# Altium project COB with RK3399.PrjPcb (part 3 of 5)

## Sheet WIFI Module Page.SchDoc: RK3399 COB Design V1.0
size A3; Author: AVIRAL MISHRA; DocumentNumber: 14; SheetNumber: 14; SheetTotal: 27; PROJECT CODE: A_V1.0
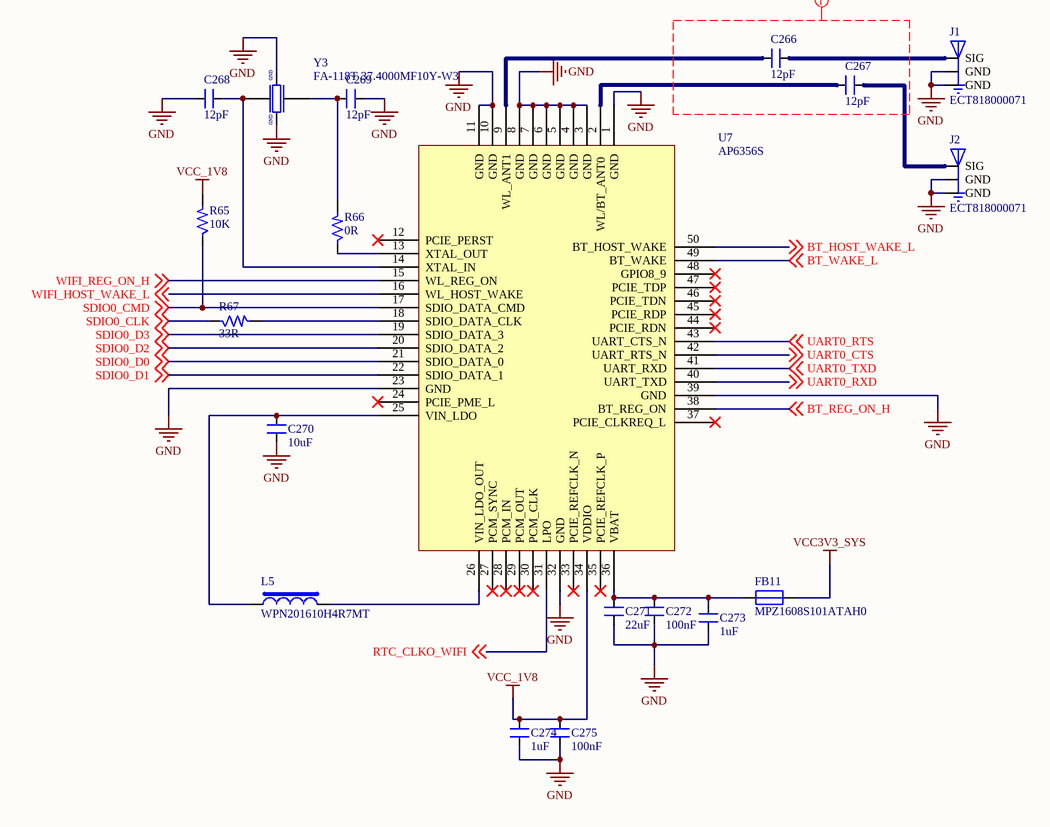
[diagram p13: WIFI Module Page.SchDoc]

### Parts
C266  12pF  [CAP_0603]
C267  12pF  [CAP_0603]
C268  12pF  [CAP_0603]
C269  12pF  [CAP_0603]
C270  10uF  [CAP_0603]
C271  22uF  [CAP_0603]
C272  100nF  [CAP_0805]
C273  1uF  [CAP_0603]
C274  1uF  [CAP_0603]
C275  100nF  [CAP_0805]
FB11  MPZ1608S101ATAH0  [RES_0603]
J1  ECT818000071  [CON3_UFL_116_SMD_ST]
J2  ECT818000071  [CON3_UFL_116_SMD_ST]
L5  WPN201610H4R7MT  [IND_62.9_110X86.6_SMD]
R65  10K  [RES_0603]
R66  0R  [RES_0603]
R67  33R  [RES_0402]
U7  AP6356S  [QFN127P600-8N]
Y3  FA-118T 37.4000MF10Y-W3  [XTAL_FA-118T 37.4000MF10Y-W3]

### Nets
GND: C268.1 C269.2 C270.1 C271.1 C272.1 C273.1 C274.1 C275.1 J1.1(GND) J1.3(GND) J2.1(GND) J2.3(GND) U7.1(GND) U7.3(GND) U7.4(GND) U7.5(GND) U7.6(GND) U7.7(GND) U7.8(GND) U7.10(GND) U7.11(GND) U7.23(GND) U7.32(GND) U7.39(GND) Y3.2 Y3.4
VCC3V3_SYS: FB11.2
VCC_1V8: C274.2 C275.2 R65.2 U7.34(VDDIO)
BT_HOST_WAKE_L: U7.50(BT_HOST_WAKE) ; off-sheet BT_HOST_WAKE_L
BT_REG_ON_H: U7.38(BT_REG_ON) ; off-sheet BT_REG_ON_H
BT_WAKE_L: U7.49(BT_WAKE) ; off-sheet BT_WAKE_L
RTC_CLKO_WIFI: U7.31(LPO) ; off-sheet RTC_CLKO_WIFI
SDIO0_CLK: R67.1 ; off-sheet SDIO0_CLK
SDIO0_CMD: R65.1 U7.17(SDIO_DATA_CMD) ; off-sheet SDIO0_CMD
SDIO0_D0: U7.21(SDIO_DATA_0) ; off-sheet SDIO0_D0
SDIO0_D1: U7.22(SDIO_DATA_1) ; off-sheet SDIO0_D1
SDIO0_D2: U7.20(SDIO_DATA_2) ; off-sheet SDIO0_D2
SDIO0_D3: U7.19(SDIO_DATA_3) ; off-sheet SDIO0_D3
UART0_CTS: U7.42(UART_RTS_N) ; off-sheet UART0_CTS
UART0_RTS: U7.43(UART_CTS_N) ; off-sheet UART0_RTS
UART0_RXD: U7.40(UART_TXD) ; off-sheet UART0_RXD
UART0_TXD: U7.41(UART_RXD) ; off-sheet UART0_TXD
WIFI_HOST_WAKE_L: U7.16(WL_HOST_WAKE) ; off-sheet WIFI_HOST_WAKE_L
WIFI_REG_ON_H: U7.15(WL_REG_ON) ; off-sheet WIFI_REG_ON_H
NetC266_1: C266.1 U7.9(WL_ANT1)
NetC266_2: C266.2 J1.2(SIG)
NetC267_1: C267.1 U7.2(WL/BT_ANT0)
NetC267_2: C267.2 J2.2(SIG)
NetC268_2: C268.2 U7.14(XTAL_IN) Y3.1
NetC269_1: C269.1 R66.2 Y3.3
NetC270_2: C270.2 L5.1 U7.25(VIN_LDO)
NetC271_2: C271.2 C272.2 C273.2 FB11.1 U7.36(VBAT)
NetL5_2: L5.2 U7.26(VIN_LDO_OUT)
NetR66_1: R66.1 U7.13(XTAL_OUT)
NetR67_2: R67.2 U7.18(SDIO_DATA_CLK)

Not connected (* = marked no-connect by the designer): U7 12(PCIE_PERST)* 24(PCIE_PME_L)* 27(PCM_SYNC)* 28(PCM_IN)* 29(PCM_OUT)* 30(PCM_CLK)* 33(PCIE_REFCLK_N)* 35(PCIE_REFCLK_P)* 37(PCIE_CLKREQ_L)* 44(PCIE_RDN)* 45(PCIE_RDP)* 46(PCIE_TDN)* 47(PCIE_TDP)* 48(GPIO8_9)*

### Layout directives
net class 50OHM_ANT: (no net found under the mark)

### Notes on the sheet
- TITLE:
- DOCUMENT NAME:
- SCALE 1:1
- This document is copyright of EsteemPCB and shall not be revealed, produced, copied, in whole or in part, nor
- PROJECT CODE:
- TEMPLATE:
- A4
- AUTHOR:
- Sheet
- of
- used for any purpose other than submitted.
- (in symbol XTAL_37.4 MHz-12pF-SMD) GND

### Library data of the parts
C266-C269 = CAP_12pF-10V-10%-0603: 12pF ±10% 10V Ceramic Capacitor X8R 0603 (1608 Metric) /; Manufacturer: KEMET; Manufacturer Part Number: C0603X120K8HAC7867; Case/Package: 0603; Supplier-1: Digikey
C270 = CAP_10uF-10V-10%-0603: 10µF ±10% 10V Ceramic Capacitor X5R 0603 (1608 Metric) /; Manufacturer Part Number: GRM188R61A106KE69J; Manufacturer: Murata Electronics; Case/Package: 0603; Supplier-1: Digikey
C271 = CAP_22uF-10V-20%-0603: as C218 on sheet PMIC_Block; Case/Package: 0603; Supplier-1: Digikey
C272 C275 = CAP_100nF-25V-10%-0805: 0.1µF ±10% 25V Ceramic Capacitor X7R 0805 (2012 Metric) /; Manufacturer: Yageo; Manufacturer Part Number: CC0805KRX7R8BB104; Case/Package: 0805; Supplier-1: Digikey
C273 C274 = CAP_1uF-16V-10%-0603: 1µF ±10% 16V Ceramic Capacitor X7R 0603 (1608 Metric) /; Manufacturer: Yageo; Manufacturer Part Number: CC0603KRX7R7BB105; Case/Package: 0603; Supplier-1: Digikey
FB11 = FB_100R-3A-100Mhz-0603: Ferrite Beads 100ohms 3A 30mOhms 0603 Ferrite Chip; Manufacturer: TDK; Mnaufacturer Part Number: MPZ1608S101ATAH0; Case/Package: 0603; Supplier-1: Digikey
J1 J2 = CON-PLG_3X1-ECT818000071-ST-SMD: SMD RF Connectors/Coaxial Connectors RoHS; Manufacturer: ECT; Manufacturer Part Number: ECT818000071; Case/Package: SMD; Supplier-1: LCSC
L5 = IND_4.7uH-0.9A-20%-SMD: 4.7uH ±20% 900mA 425mΩ SMD,2.0x1.6x1.0mm Power Inductors RoHS /; Manufacturer: Sunlord; Manufacturer Part Number: WPN201610H4R7MT; Case/Package: SMD; Supplier-1: LCSC
R65 = RES_10K-0.1W-1%-0603: 10 kOhms ±1% 0.1W, 1/10W Chip Resistor 0603 (1608 Metric) Thick Film /; Manufacturer: Yageo; Manufacturer Part Number: RC0603FR-0710KL; Case/Package: 0603; Supplier-1: Digikey
R66 = RES_0R-0.1W-1%-0603: 0 Ohms Jumper 0.1W, 1/10W Chip Resistor 0603 (1608 Metric) Thick Film; Manufacturer: Yageo; Manufacturer Part Number: RC0603JR-070RL; Case/Package: 0603; Supplier-1: Digikey
R67 = RES_33R-0.1W-1%-0402: 33 Ohms ±1% 0.1W, 1/10W Chip Resistor 0402 (1005 Metric) Automotive AEC-Q200 Thick Film /; Manufacturer: Panasonic Electronic Components; Manufacturer Part Number: ERJ-2RKF33R0X; Case/Package: 0402; Supplier-1: Digikey
U7 = IC_AP6356S: AMPAK Technology would like to announce a low-cost and low-power consumption module / which has all of the WiFi and Bluetooth functionalities.; Manufacturer: Rockchip; Manufacturer Part Number: AP6356S; Case/Package: NA; Supplier-1: Rockchip
Y3 = XTAL_37.4 MHz-12pF-SMD: Crystals 37.4MHz 10ppm 12pF -30C +85C; Manufacturer: Epson Timing; Manufacturer Part Number: FA-118T 37.4000MF10Y-W3; Case/Package: SMD; Supplier-1: Mouser

## Sheet Regulators and Buck Converters.SchDoc: RK3399 COB Design V1.0
size A3; Author: ABC; Organization: Altium Limited; Address1: L3, 12a Rodborough Rd; Address2: Frenchs Forest; Address3: NSW; Address4: Australia 2086; DocumentNumber: 15; SheetNumber: 15; SheetTotal: 27; PROJECT CODE: A_V1.0
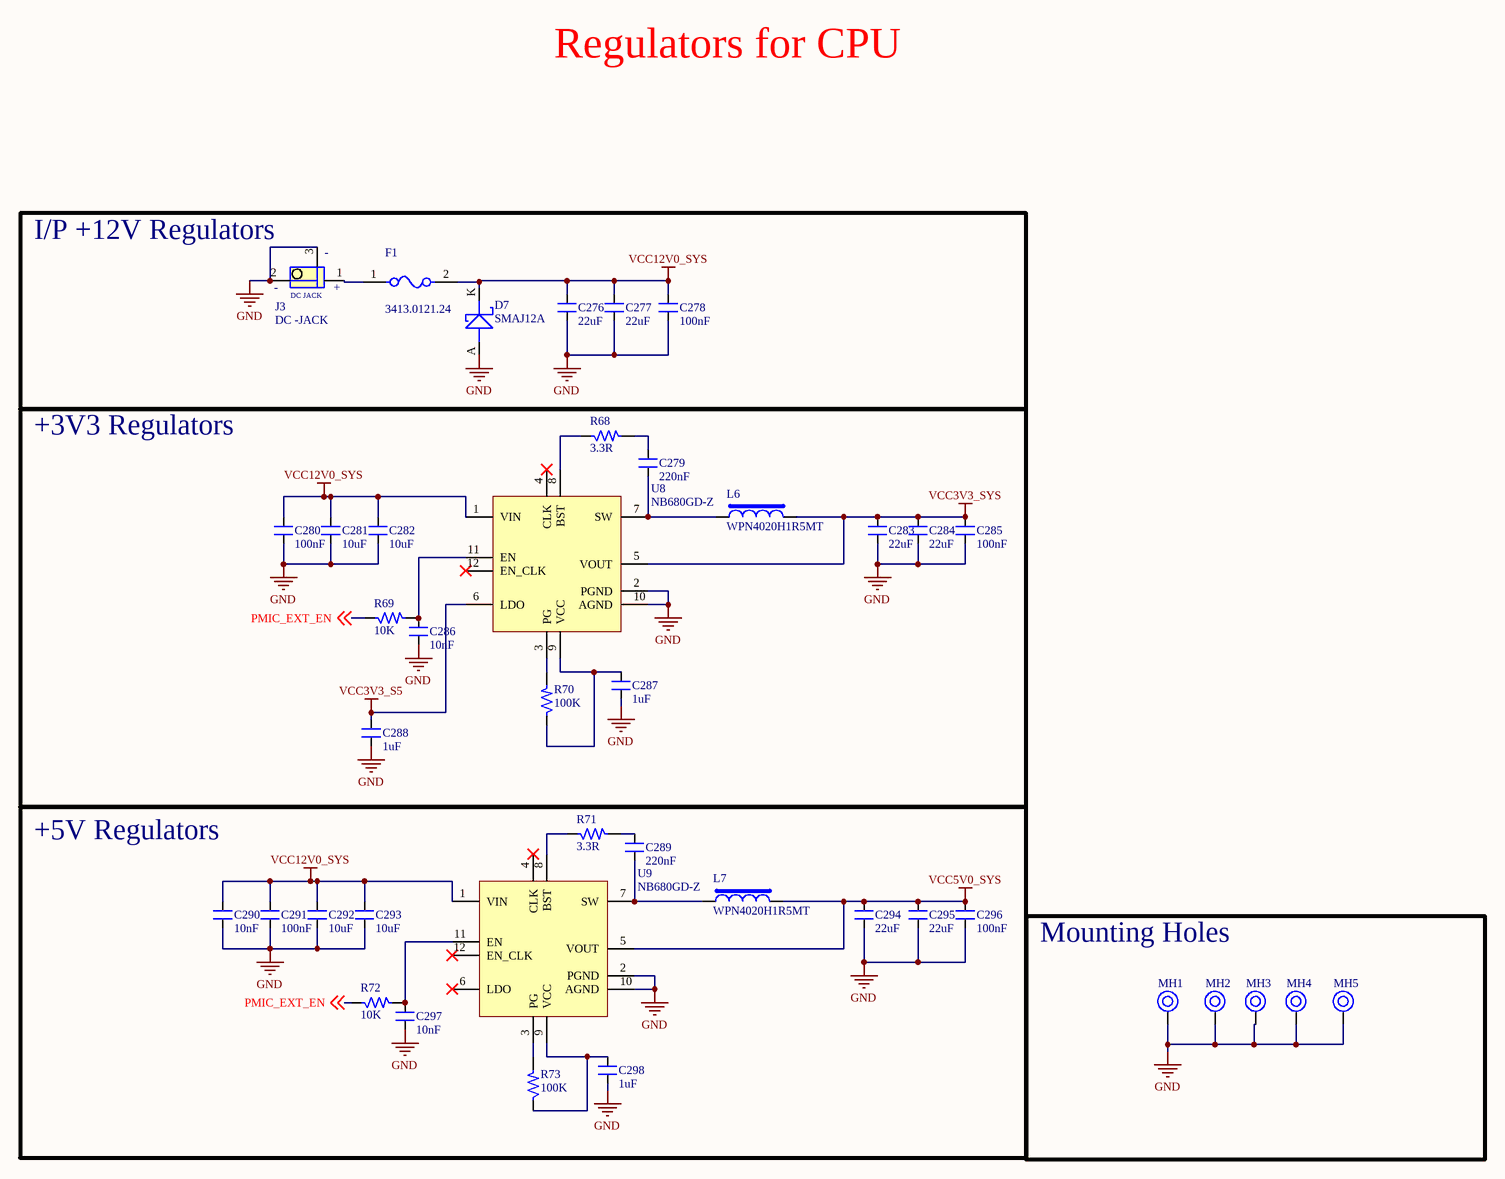
[diagram p14: Regulators and Buck Converters.SchDoc]

### Parts
C276  22uF  [CAP_0805]
C277  22uF  [CAP_0805]
C278  100nF  [CAP_0805]
C279  220nF  [CAP_0603]
C280  100nF  [CAP_0805]
C281  10uF  [CAP_0805]
C282  10uF  [CAP_0805]
C283  22uF  [CAP_0805]
C284  22uF  [CAP_0805]
C285  100nF  [CAP_0603]
C286  10nF  [CAP_0603]
C287  1uF  [CAP_0603]
C288  1uF  [CAP_0603]
C289  220nF  [CAP_0603]
C290  10nF  [CAP_0603]
C291  100nF  [CAP_0805]
C292  10uF  [CAP_0805]
C293  10uF  [CAP_0805]
C294  22uF  [CAP_0805]
C295  22uF  [CAP_0805]
C296  100nF  [CAP_0603]
C297  10nF  [CAP_0603]
C298  1uF  [CAP_0603]
D7  SMAJ12A  [DIO_SMA_DO-214AC]
F1  3413.0121.24  [RES_1206]
J3  DC -JACK  [CON3_129_PJ-002A_TH_RA]
L6  WPN4020H1R5MT  [IND_1616]
L7  WPN4020H1R5MT  [IND_1616]
MH1  Mounting Hole  [MOUNTING]  (value not drawn)  (no BOM)
MH2  Mounting Hole  [MOUNTING]  (value not drawn)  (no BOM)
MH3  Mounting Hole  [MOUNTING]  (value not drawn)  (no BOM)
MH4  Mounting Hole  [MOUNTING]  (value not drawn)  (no BOM)
MH5  Mounting Hole  [MOUNTING]  (value not drawn)  (no BOM)
R68  3.3R  [RES_0603]
R69  10K  [RES_0603]
R70  100K  [RES_0603]
R71  3.3R  [RES_0603]
R72  10K  [RES_0603]
R73  100K  [RES_0603]
U8  NB680GD-Z  [QFN-12_19_118X118_SMD]
U9  NB680GD-Z  [QFN-12_19_118X118_SMD]

### Blocks framed on the sheet
I/P +12V Regulators: C276-C278 D7 F1 J3
+3V3 Regulators: C279-C288 L6 R68-R70 U8
+5V Regulators: C289-C298 L7 R71-R73 U9
Mounting Holes: MH1-MH5

### Nets
GND: C276.1 C277.1 C278.1 C280.1 C281.1 C282.1 C283.1 C284.1 C285.1 C286.1 C287.1 C288.1 C290.1 C291.1 C292.1 C293.1 C294.1 C295.1 C296.1 C297.1 C298.1 D7.A J3.2 J3.3(-) MH1.1 MH2.1 MH3.1 MH4.1 MH5.1 U8.2(PGND) U8.10(AGND) U9.2(PGND) U9.10(AGND)
VCC3V3_S5: C288.2 U8.6(LDO)
VCC3V3_SYS: C283.2 C284.2 C285.2 L6.2 U8.5(VOUT)
VCC5V0_SYS: C294.2 C295.2 C296.2 L7.2 U9.5(VOUT)
VCC12V0_SYS: C276.2 C277.2 C278.2 C280.2 C281.2 C282.2 C290.2 C291.2 C292.2 C293.2 D7.K F1.2 U8.1(VIN) U9.1(VIN)
PMIC_EXT_EN: R69.1 R72.1 ; off-sheet PMIC_EXT_EN
NetC279_1: C279.1 L6.1 U8.7(SW)
NetC279_2: C279.2 R68.2
NetC286_2: C286.2 R69.2 U8.11(EN)
NetC287_2: C287.2 R70.1 U8.9(VCC)
NetC289_1: C289.1 L7.1 U9.7(SW)
NetC289_2: C289.2 R71.2
NetC297_2: C297.2 R72.2 U9.11(EN)
NetC298_2: C298.2 R73.1 U9.9(VCC)
NetF1_1: F1.1 J3.1
NetR68_1: R68.1 U8.8(BST)
NetR70_2: R70.2 U8.3(PG)
NetR71_1: R71.1 U9.8(BST)
NetR73_2: R73.2 U9.3(PG)

Not connected (* = marked no-connect by the designer): U8 4(CLK)* 12(EN_CLK)*; U9 4(CLK)* 6(LDO)* 12(EN_CLK)*

### Notes on the sheet
- Regulators for CPU
- TITLE:
- DOCUMENT NAME:
- SCALE 1:1
- This document is copyright of Esteempcb and shall not be revealed, produced, copied, in whole or in part, nor
- PROJECT CODE:
- TEMPLATE:
- A3
- AUTHOR:
- Sheet
- of
- used for any purpose other than submitted.
- (in symbol CON-PLG_3X1-228-DC_JACK) +; DC JACK

### Library data of the parts
C276 C277 C283 C284 C294 C295 = CAP_22uF-25V-20%-0805: 22µF ±20% 25V Ceramic Capacitor X5R 0805 (2012 Metric) /; Manufacturer: Murata Electronics; Manufacturer Part Number: GRM21BR61E226ME44K; Case/Package: 0805; Supplier-1: Digikey
C278 C280 C291 = CAP_100nF-25V-10%-0805: 0.1µF ±10% 25V Ceramic Capacitor X7R 0805 (2012 Metric) /; Manufacturer: Yageo; Manufacturer Part Number: CC0805KRX7R8BB104; Case/Package: 0805; Supplier-1: Digikey
C279 C289 = CAP_220nF-10V-10%-0603: 0.22µF ±10% 10V Ceramic Capacitor X7R 0603 (1608 Metric) /; Manufacturer: Yageo; Manufacturer Part Number: CC0603KRX7R6BB224; Case/Package: 0603; Supplier-1: Digikey
C281 C282 C292 C293 = CAP_10uF-25V-10%-0805: 10µF ±10% 25V Ceramic Capacitor X5R 0805 (2012 Metric) /; Manufacturer: Murata Electronics; Manufacturer Part Number: GRM21BR61E106KA73K; Case/Package: 0805; Supplier-1: Digikey
C285 C296 = CAP_100nF-10V-5%-0603: 0.1µF ±10% 10V Ceramic Capacitor X7R 0603 (1608 Metric) /; Manufacturer: Yageo; Manufacturer Part Number: CC0603KRX7R6BB104; Case/Package: 0603; Supplier-1: Digikey
C286 C290 C297 = CAP_10nF-10V-10%-0603: 10000pF ±10% 10V Ceramic Capacitor X7R 0603 (1608 Metric) /; Manufacturer: KEMET; Manufacturer Part Number: C0603C103K8RACTU; Case/Package: 0603; Supplier-1: Digikey
C287 C288 C298 = CAP_1uF-10V-5%-0603: 1µF ±10% 10V Ceramic Capacitor X5R 0603 (1608 Metric) /; Manufacturer: Samsung Electro-Mechanics; Manufacturer Part Number: CL10A105KP8NNNC; Case/Package: 0603; Supplier-1: Digikey
D7 = DIO-T_13.3V-19.9V-20.1A-DO-214AC: 19.9V Clamp 20.1A Ipp Tvs Diode Surface Mount DO-214AC (SMA); Manufacturer: Littelfuse Inc.; Manufacturer Part Number: SMAJ12A; Case/Package: DO-214AC; Supplier-1: Digikey
F1 = FUSE_3A-32V-1206: 3A 32V AC 63V DC Fuse Board Mount (Cartridge Style Excluded) Surface Mount 1206 (3216 Metric); Manufacturer: Schurter Inc.; Manufacturer Part Number: 3413.0121.24; Case/Package: 1206; Supplier-1: Digikey
J3 = CON-PLG_3X1-228-DC_JACK: 3 Pins, 1 Row 228mil Pitch, right angle Connector, male; Manufacturer: JST; Manufacturer Part Number: PJ-002A; Case/Package: TH-CON; Supplier-1: SP ROAD
L6 L7 = IND_1.5uH-6A-20%-SMD: Wire Wound SMD Power Inductors – WPN Series / Operating Temp. : -40℃~+125℃ (Including self-heating) /; Manufacturer: Sunlord; Mnaufcaturer Part Number: WPN4020H1R5MT; Case/Package: SMD; Supplier-1: NA
MH1-MH5 = MH_3.5H_6D: Manufacturer Part Number: NA; Case/Package: TH; Manufacturer: NA; Supplier-1: NA
R68 R71 = RES_3.3R-0.1W-1%-0603: 3.3 Ohms ±1% 0.1W, 1/10W Chip Resistor 0603 (1608 Metric) Automotive AEC-Q200, Current Sense Thick Film /; Manufacturer: Panasonic Electronic Components; Manufacturer Part Number: ERJ-3RQF3R3V; Case/Package: 0603; Supplier-1: Digikey
R69 R72 = RES_10K-0.1W-1%-0603: 10 kOhms ±1% 0.1W, 1/10W Chip Resistor 0603 (1608 Metric) Thick Film /; Manufacturer: Yageo; Manufacturer Part Number: RC0603FR-0710KL; Case/Package: 0603; Supplier-1: Digikey
R70 R73 = RES_100K-0.1W-1%-0603: 100 kOhms ±1% 0.1W, 1/10W Chip Resistor 0603 (1608 Metric) Automotive AEC-Q200 Thick Film /; Manufacturer: tackpole Electronics Inc; Manufacturer Part Number: RMCF0603FT100K; Case/Package: 0603; Supplier-1: Digikey
U8 U9 = REG_3.3V-26V-8A-QFN-12: Switching Voltage Regulators 26V Fixed 3.3 V-8A Sync Buck Converter; Manufacturer: Monolithic Power Systems (MPS); Manufacturer Part Number: NB680GD-Z; Case/Package: QFN-12; Supplier-1: Mouser

## Sheet Power Supply for CPU Blocks.SchDoc: RK3399 COB Design V1.0
size A3; Author: ABC; Organization: Altium Limited; Address1: L3, 12a Rodborough Rd; Address2: Frenchs Forest; Address3: NSW; Address4: Australia 2086; DocumentNumber: 16; SheetNumber: 16; SheetTotal: 27; PROJECT CODE: A_V1.0
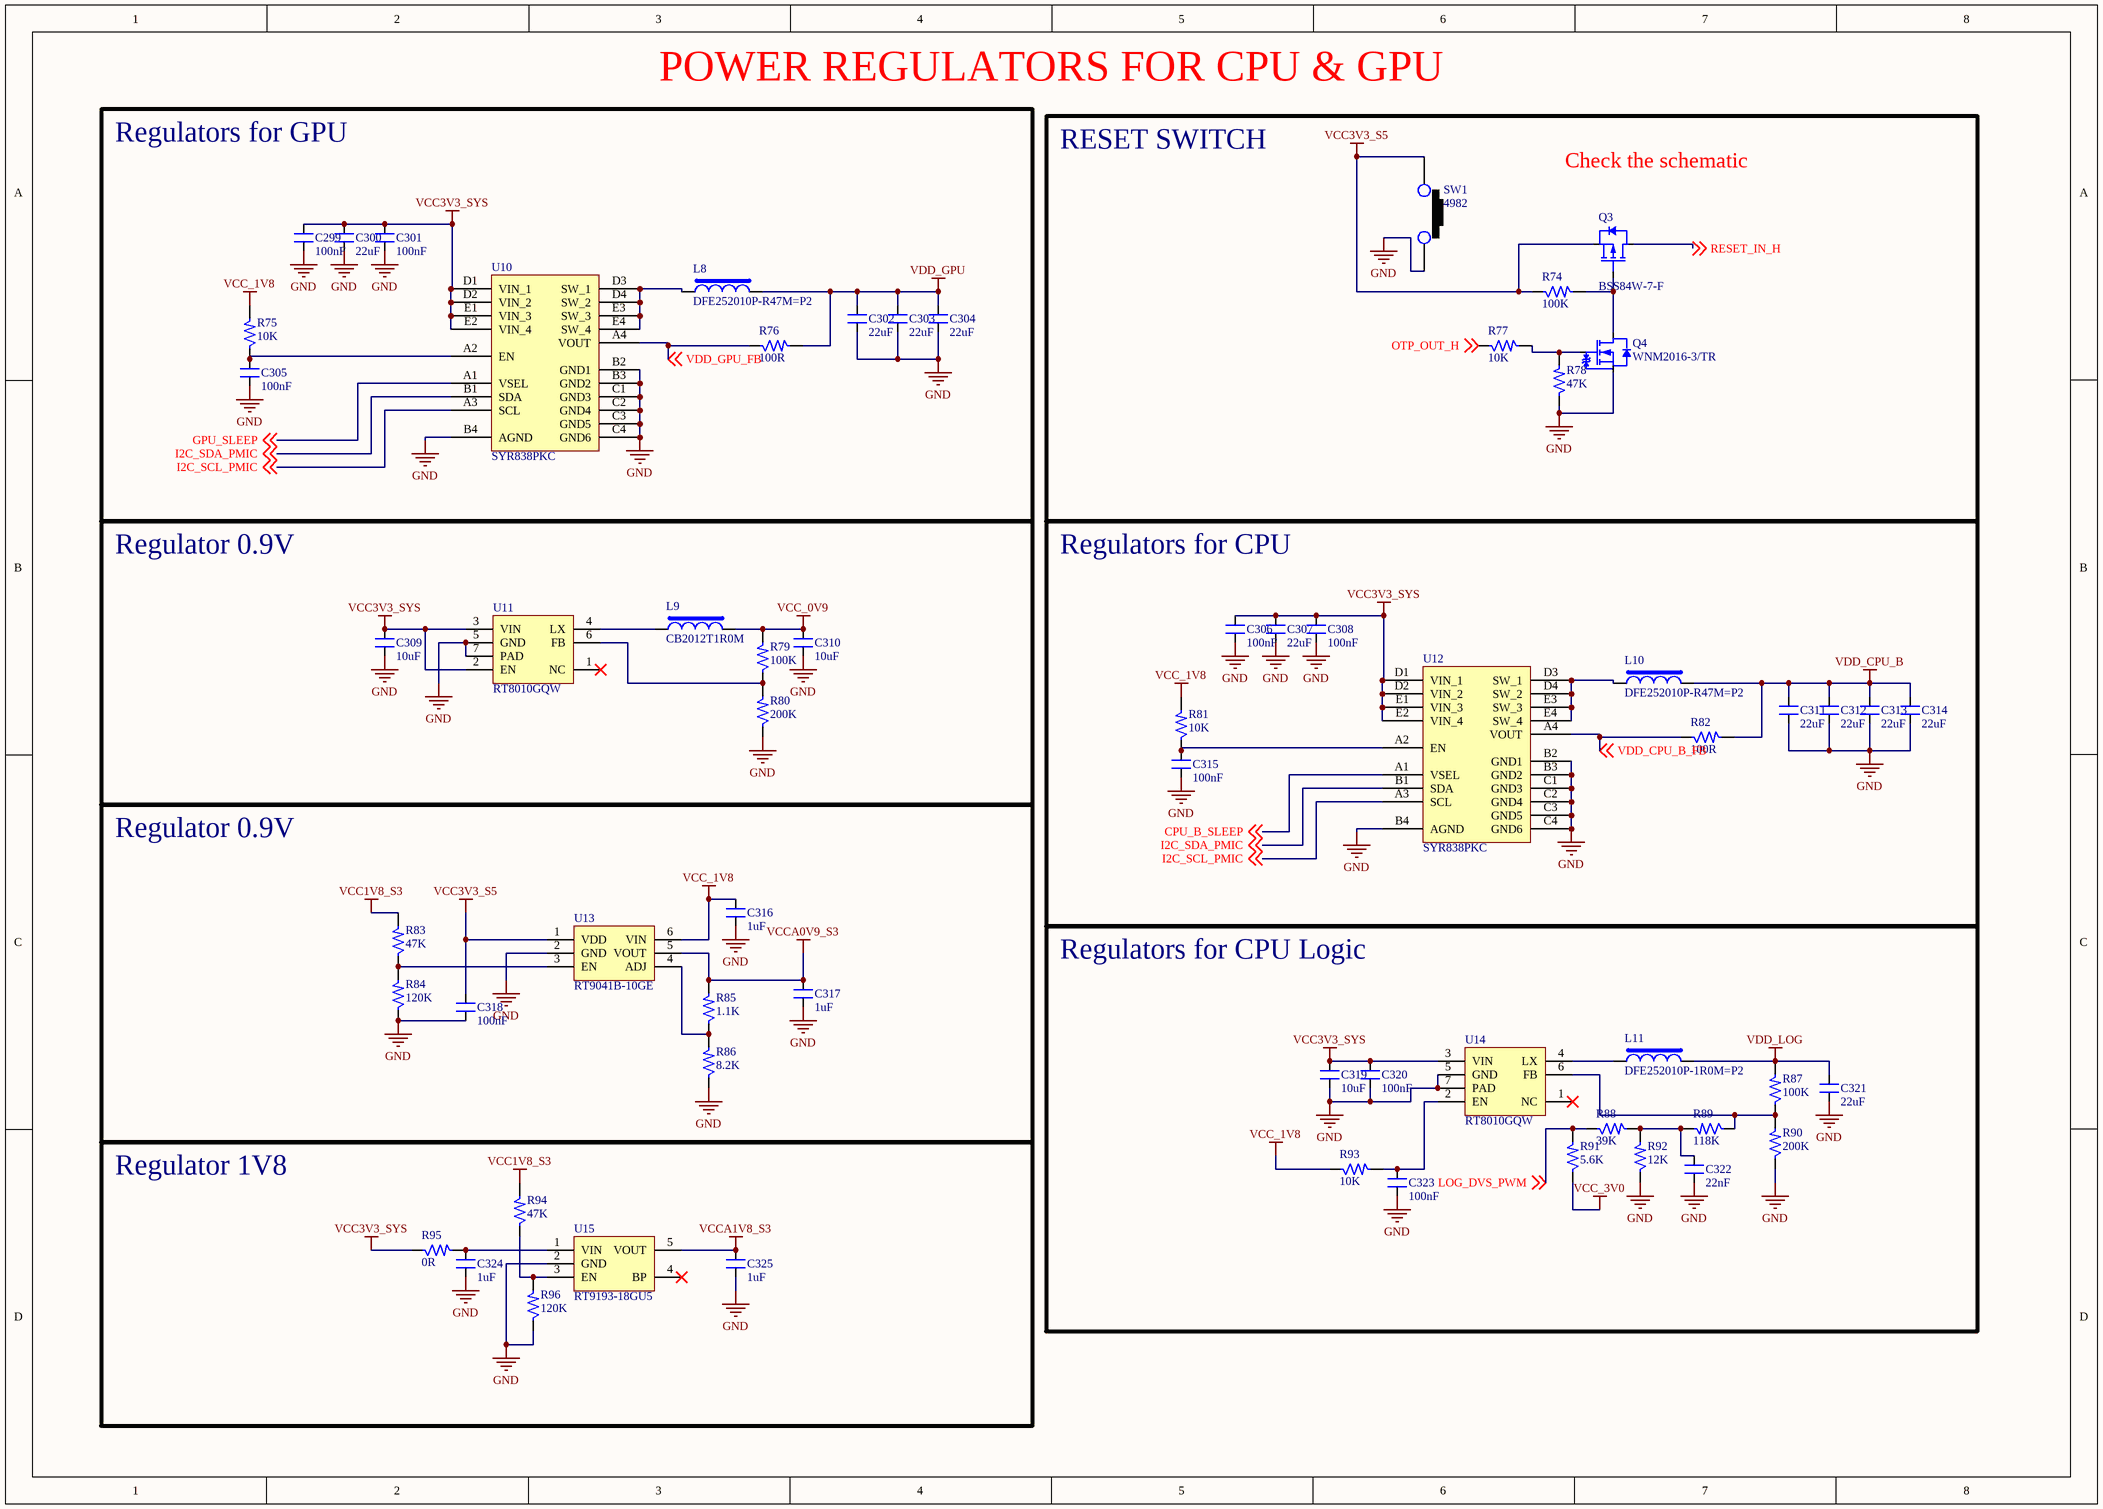
[diagram p15: Power Supply for CPU Blocks.SchDoc]

### Parts
C299  100nF  [CAP_0603]
C300  22uF  [CAP_0603]
C301  100nF  [CAP_0603]
C302  22uF  [CAP_0805]
C303  22uF  [CAP_0805]
C304  22uF  [CAP_0805]
C305  100nF  [CAP_0603]
C306  100nF  [CAP_0603]
C307  22uF  [CAP_0603]
C308  100nF  [CAP_0603]
C309  10uF  [CAP_0603]
C310  10uF  [CAP_0603]
C311  22uF  [CAP_0805]
C312  22uF  [CAP_0805]
C313  22uF  [CAP_0805]
C314  22uF  [CAP_0805]
C315  100nF  [CAP_0603]
C316  1uF  [CAP_0603]
C317  1uF  [CAP_0603]
C318  100nF  [CAP_0603]
C319  10uF  [CAP_0603]
C320  100nF  [CAP_0603]
C321  22uF  [CAP_0603]
C322  22nF  [CAP_0603]
C323  100nF  [CAP_0603]
C324  1uF  [CAP_0603]
C325  1uF  [CAP_0603]
L8  DFE252010P-R47M=P2  [IND_1008]
L9  CB2012T1R0M  [IND_0805]
L10  DFE252010P-R47M=P2  [IND_1008]
L11  DFE252010P-1R0M=P2  [IND_1008]
Q3  BSS84W-7-F  [SOT-323-3]
Q4  WNM2016-3/TR  [SOT 23-3]
R74  100K  [RES_0603]
R75  10K  [RES_0603]
R76  100R  [RES_0603]
R77  10K  [RES_0603]
R78  47K  [RES_0603]
R79  100K  [RES_0603]
R80  200K  [RES_0603]
R81  10K  [RES_0603]
R82  100R  [RES_0603]
R83  47K  [RES_0603]
R84  120K  [RES_0603]
R85  1.1K  [RES_0603]
R86  8.2K  [RES_0603]
R87  100K  [RES_0603]
R88  39K  [RES_0603]
R89  118K  [RES_0603]
R90  200K  [RES_0603]
R91  5.6K  [RES_0603]
R92  12K  [RES_0603]
R93  10K  [RES_0603]
R94  47K  [RES_0603]
R95  0R  [RES_0603]
R96  120K  [RES_0603]
SW1  4982  [SW_177_39.3X77.7_SMD]
U10  SYR838PKC  [CSP20_15.7_100x84_SMD]
U11  RT8010GQW  [WDFN-6_26_133X100_SMD]
U12  SYR838PKC  [CSP20_15.7_100x84_SMD]
U13  RT9041B-10GE  [SOT23-6]
U14  RT8010GQW  [WDFN-6_26_133X100_SMD]
U15  RT9193-18GU5  [SOT23-5]

### Blocks framed on the sheet
POWER REGULATORS FOR CPU & GPU: C299-C305 L8 R75 R76 U10
RESET SWITCH: Q3 Q4 R74 R77 R78 SW1
Regulator 0.9V: C309 C310 L9 R79 R80 U11
Regulators for CPU: C306-C308 C311-C315 L10 R81 R82 U12
Regulator 0.9V: C316-C318 R83-R86 U13
Regulators for CPU Logic: C319-C323 L11 R87-R93 U14
Regulator 1V8: C324 C325 R94-R96 U15

### Nets
GND: C299.1 C300.1 C301.1 C302.1 C303.1 C304.1 C305.1 C306.1 C307.1 C308.1 C309.1 C310.1 C311.1 C312.1 C313.1 C314.1 C315.1 C316.1 C317.1 C318.1 C319.1 C320.1 C321.1 C322.1 C323.1 C324.1 C325.1 Q4.2(S) R78.1 R80.1 R84.1 R86.1 R90.1 R92.1 R96.1 SW1.2 U10.B2(GND1) U10.B3(GND2) U10.B4(AGND) U10.C1(GND3) U10.C2(GND4) U10.C3(GND5) U10.C4(GND6) U11.5(GND) U11.7(PAD) U12.B2(GND1) U12.B3(GND2) U12.B4(AGND) U12.C1(GND3) U12.C2(GND4) U12.C3(GND5) U12.C4(GND6) U13.2(GND) U14.5(GND) U14.7(PAD) U15.2(GND)
VCC1V8_S3: R83.2 R94.2
VCC3V3_S5: C318.2 Q3.2(S) R74.1 SW1.1 U13.1(VDD)
VCC3V3_SYS: C299.2 C300.2 C301.2 C306.2 C307.2 C308.2 C309.2 C319.2 C320.2 R95.1 U10.D1(VIN_1) U10.D2(VIN_2) U10.E1(VIN_3) U10.E2(VIN_4) U11.2(EN) U11.3(VIN) U12.D1(VIN_1) U12.D2(VIN_2) U12.E1(VIN_3) U12.E2(VIN_4) U14.3(VIN)
VCC_0V9: C310.2 L9.2 R79.2
VCC_1V8: C316.2 R75.2 R81.2 R93.1 U13.6(VIN)
VCC_3V0: R91.1
VCCA0V9_S3: C317.2 R85.2 U13.5(VOUT)
VCCA1V8_S3: C325.2 U15.5(VOUT)
VDD_CPU_B: C311.2 C312.2 C313.2 C314.2 L10.2 R82.2
VDD_GPU: C302.2 C303.2 C304.2 L8.2 R76.2
VDD_LOG: C321.2 L11.2 R87.2
CPU_B_SLEEP: U12.A1(VSEL) ; off-sheet CPU_B_SLEEP
GPU_SLEEP: U10.A1(VSEL) ; off-sheet GPU_SLEEP
I2C_SCL_PMIC: U10.A3(SCL) U12.A3(SCL) ; off-sheet I2C_SCL_PMIC
I2C_SDA_PMIC: U10.B1(SDA) U12.B1(SDA) ; off-sheet I2C_SDA_PMIC
LOG_DVS_PWM: R88.1 R91.2 ; off-sheet LOG_DVS_PWM
OTP_OUT_H: R77.1 ; off-sheet OTP_OUT_H
RESET_IN_H: Q3.3(D) ; off-sheet RESET_IN_H
VDD_CPU_B_FB: R82.1 U12.A4(VOUT) ; off-sheet VDD_CPU_B_FB
VDD_GPU_FB: R76.1 U10.A4(VOUT) ; off-sheet VDD_GPU_FB
NetC305_2: C305.2 R75.1 U10.A2(EN)
NetC315_2: C315.2 R81.1 U12.A2(EN)
NetC322_2: C322.2 R88.2 R89.2 R92.2
NetC323_2: C323.2 R93.2 U14.2(EN)
NetC324_2: C324.2 R95.2 U15.1(VIN)
NetL8_1: L8.1 U10.D3(SW_1) U10.D4(SW_2) U10.E3(SW_3) U10.E4(SW_4)
NetL9_1: L9.1 U11.4(LX)
NetL10_1: L10.1 U12.D3(SW_1) U12.D4(SW_2) U12.E3(SW_3) U12.E4(SW_4)
NetL11_1: L11.1 U14.4(LX)
NetQ3_1: Q3.1(G) Q4.3(D) R74.2
NetQ4_1: Q4.1(G) R77.2 R78.2
NetR79_1: R79.1 R80.2 U11.6(FB)
NetR83_1: R83.1 R84.2 U13.3(EN)
NetR85_1: R85.1 R86.2 U13.4(ADJ)
NetR87_1: R87.1 R89.1 R90.2 U14.6(FB)
NetR94_1: R94.1 R96.2 U15.3(EN)

Not connected (* = marked no-connect by the designer): U11 1(NC)*; U14 1(NC)*; U15 4(BP)*

### Notes on the sheet
- Regulators for GPU
- Check the schematic
- TITLE:
- DOCUMENT NAME:
- SCALE 1:1
- This document is copyright of Esteempcb and shall not be revealed, produced, copied, in whole or in part, nor
- PROJECT CODE:
- TEMPLATE:
- A3
- AUTHOR:
- Sheet
- of
- used for any purpose other than submitted.

### Library data of the parts
C299 C301 C305 C306 C308 C315 C318 C320 C323 = CAP_100nF-10V-5%-0603: as C285 on sheet Regulators and Buck Converters; Case/Package: 0603; Supplier-1: Digikey
C300 C307 C321 = CAP_22uF-10V-20%-0603: 22µF ±20% 10V Ceramic Capacitor X5R 0603 (1608 Metric) /; Manufacturer: Murata Electronics; Manufacturer Part Number: GRM188R61A226ME15D; Case/Package: 0603; Supplier-1: Digikey
C302-C304 C311-C314 = CAP_22uF-25V-20%-0805: as C276 on sheet Regulators and Buck Converters; Case/Package: 0805; Supplier-1: Digikey
C309 C310 C319 = CAP_10uF-10V-10%-0603: 10µF ±10% 10V Ceramic Capacitor X5R 0603 (1608 Metric) /; Manufacturer Part Number: GRM188R61A106KE69J; Manufacturer: Murata Electronics; Case/Package: 0603; Supplier-1: Digikey
C316 C317 C324 C325 = CAP_1uF-10V-5%-0603: as C287 on sheet Regulators and Buck Converters; Case/Package: 0603; Supplier-1: Digikey
C322 = CAP_22nF-10V-10%-0603: 0.022µF ±10% 10V Ceramic Capacitor X7R 0603 (1608 Metric) /; Manufacturer Part Number: LMF107B7223KAHT; Manufacturer: Taiyo Yuden; Case/Package: 0603; Supplier-1: Digikey
L8 L10 = IND_470nH-5A-20%-1008: 470nH Shielded Wirewound Inductor 5A 35mOhm Max 1008 (2520 Metric); Manufacturer: Murata Electronics; Manufacturer Part Number: DFE252010P-R47M=P2; Case/Package: 1008; Supplier-1: Digikey
L9 = IND_1uF-0.5A-20%-0805: 1uH ±20% 500mA 150mΩ 0805 Inductors (SMD) RoHS /; Manufacturer: Taiyo Yuden; Manufacturer Part Number: CB2012T1R0M; Case/Package: 0805; Supplier-1: LCSC
L11 = IND_1uH-3.8A-20%-1008: 1µH Shielded Wirewound Inductor 3.8A 54mOhm Max 1008 (2520 Metric) /; Manufacturer: Murata Electronics; Manufacturer Part Number: DFE252010P-1R0M=P2; Case/Package: 1008; Supplier-1: Digikey
Q3 = MOSFET-P_50V-130mA-SOT-323: P-Channel 50V 130mA (Ta) 200mW (Ta) Surface Mount SOT-323; Manufacturer: Diodes Incorporated; Manufacturer Part Number: BSS84W-7-F; Case/Package: SOT-323; Supplier-1: Digikey
Q4 = MOSFET-N_20V-2.9A-SOT-23: N Channel 20V 2.9A 1V @ 250uA 47mΩ @ 3.6A,4.5V 700mW SOT-23(SOT-23-3) MOSFET RoHS /; Manufacturer: WILLSEMI(Will Semicon); Manufacturer Part Number: WNM2016-3/TR; Case/Package: SOT-23(SOT-23-3); Supplier-1: LCSC
R74 R79 R87 = RES_100K-0.1W-1%-0603: as R70 on sheet Regulators and Buck Converters; Case/Package: 0603; Supplier-1: Digikey
R75 R77 R81 R93 = RES_10K-0.1W-1%-0603: as R69 on sheet Regulators and Buck Converters; Case/Package: 0603; Supplier-1: Digikey
R76 R82 = RES_100R-0.1W-1%-0603: 100 Ohms ±1% 0.1W, 1/10W Chip Resistor 0603 (1608 Metric) Thick Film /; Manufacturer: Yageo; Manufacturer Part Number: RC0603FR-07100RL; Case/Package: 0603; Supplier-1: Digikey
R78 R83 R94 = RES_47K-0.1W-1%-0603: 47 kOhms ±1% 0.1W, 1/10W Chip Resistor 0603 (1608 Metric) Thick Film /; Manufacturer: Yageo; Manufacturer Part Number: RC0603FR-0747KL; Case/Package: 0603; Supplier-1: Digikey
R80 R90 = RES_200K-0.1W-1%-0603: 200 kOhms ±1% 0.1W, 1/10W Chip Resistor 0603 (1608 Metric) Thick Film /; Manufacturer: Yageo; Manufacturer Part number: RC0603FR-07200KL; Case/Package: 0603; Supplier-1: Digikey
R84 R96 = RES_120K-0.1W-1%-0603: 120 kOhms ±1% 0.1W, 1/10W Chip Resistor 0603 (1608 Metric) Thin Film /; Manufacturer: Yageo; Manufacturer Part Number: RT0603FRE07120KL; Case/Package: 0603; Supplier-1: Digikey
R85 = RES_1.1K-0.1W-1%-0603: 47 kOhms ±1% 0.1W, 1/10W Chip Resistor 0603 (1608 Metric) Thick Film /; Manufacturer: Yageo; Manufacturer Part Number: RC0603FR-0747KL; Case/Package: 0603; Supplier-1: Digikey
R86 = RES_8.2K-0.1W-1%-0603: 8.2 kOhms ±1% 0.1W, 1/10W Chip Resistor 0603 (1608 Metric) Automotive AEC-Q200 Thick Film /; Manufacturer: Stackpole Electronics Inc; Manufacturer Part Number: RMCF0603FT8K20; Case/Package: 0603; Supplier-1: Digikey
R88 = RES_39K-0.1W-1%-0603: 39 kOhms ±1% 0.1W, 1/10W Chip Resistor 0603 (1608 Metric) Automotive AEC-Q200, Moisture Resistant Thick Film /; Manufacturer: TE Connectivity Passive Product; Manufacturer Part Number: CRGCQ0603F39K; Case/Package: 0603; Supplier-1: Digikey
R89 = RES_118K-0.1W-1%-0603: 118 kOhms ±1% 0.1W, 1/10W Chip Resistor 0603 (1608 Metric) Automotive AEC-Q200 Thick Film /; Manufacturer: Stackpole Electronics Inc; Manuafcturer Part Number: RMCF0603FT118K; Case/Package: 0603; Supplier-1: Digikey
R91 = RES_5.6K-0.1W-1%-0603: 5.6 kOhms ±1% 0.1W, 1/10W Chip Resistor 0603 (1608 Metric) Automotive AEC-Q200, Moisture Resistant Thick Film /; Manufacturer: TE Connectivity Passive Product; Manufacturer Part Number: CRGCQ0603F5K6; Case/Package: 0603; Supplier-1: Digikey
R92 = RES_12K-0.1W-1%-0603: 12 kOhms ±1% 0.1W, 1/10W Chip Resistor 0603 (1608 Metric) Thick Film /; Manufacturer: TE Connectivity Passive Product; Manufacturer Part Number: CRG0603F12K; Case/Package: 0603; Supplier-1: Digikey
R95 = RES_0R-0.1W-1%-0603: 0 Ohms Jumper 0.1W, 1/10W Chip Resistor 0603 (1608 Metric) Thick Film; Manufacturer: Yageo; Manufacturer Part Number: RC0603JR-070RL; Case/Package: 0603; Supplier-1: Digikey
SW1 = SW1_4982: Tactile Switch 3x4x2mm SMD 2-Pin; Manufacturer: NA; Manufacturer Part Number: NA; Case/Package: SMD; Supplier-1: Sunrom
U10 U12 = IC_SYR838PKC: Step-Down Positive Programmable 1 6A 2.4MHz CSP1.56*1.96-20 DC-DC Converters RoHS; Manufacturer: Silergy Corp; Manufacturer Part Number: SYR838PKC; Case/Package: CSP1.56*1.96-20; Supplier-1: LCSC
U11 U14 = REG-ADJ_5.5V-5.5V-1A-6-WDFN: Buck Switching Regulator IC Positive Adjustable 0.6V 1 Output 1A 6-WDFN Exposed Pad; Manufacturer: Richtek USA Inc.; Manufacturer Part Number: RT8010GQW; Case/Package: 6-WDFN; Supplier-1: Digikey
U13 = REG-ADJ_5.5V-2.5V-0.5A-SOT-23-6: Linear Voltage Regulator IC 1 Output 500mA SOT-23-6; Manufacturer: Richtek USA Inc.; Manufacturer Part Number: RT9041B-10GE; Case/Package: SOT-23-6; Supplier-1: Digikey
U15 = REG_1.8V-300mA-5.5V-SC70-5: Linear Voltage Regulator IC 1 Output 300mA SC-70-5; Manufacturer: Richtek USA Inc.; Manufacturer Part Number: RT9193-18GU5; Case/Package: SC70-5; Supplier-1: Digikey

## Sheet RGMII ETH PHY.SchDoc: RK3399 COB Design V1.0
size A4; Author: AVIRAL MISHRA; DocumentNumber: 17; SheetNumber: 17; SheetTotal: 27; PROJECT CODE: A_V1.0
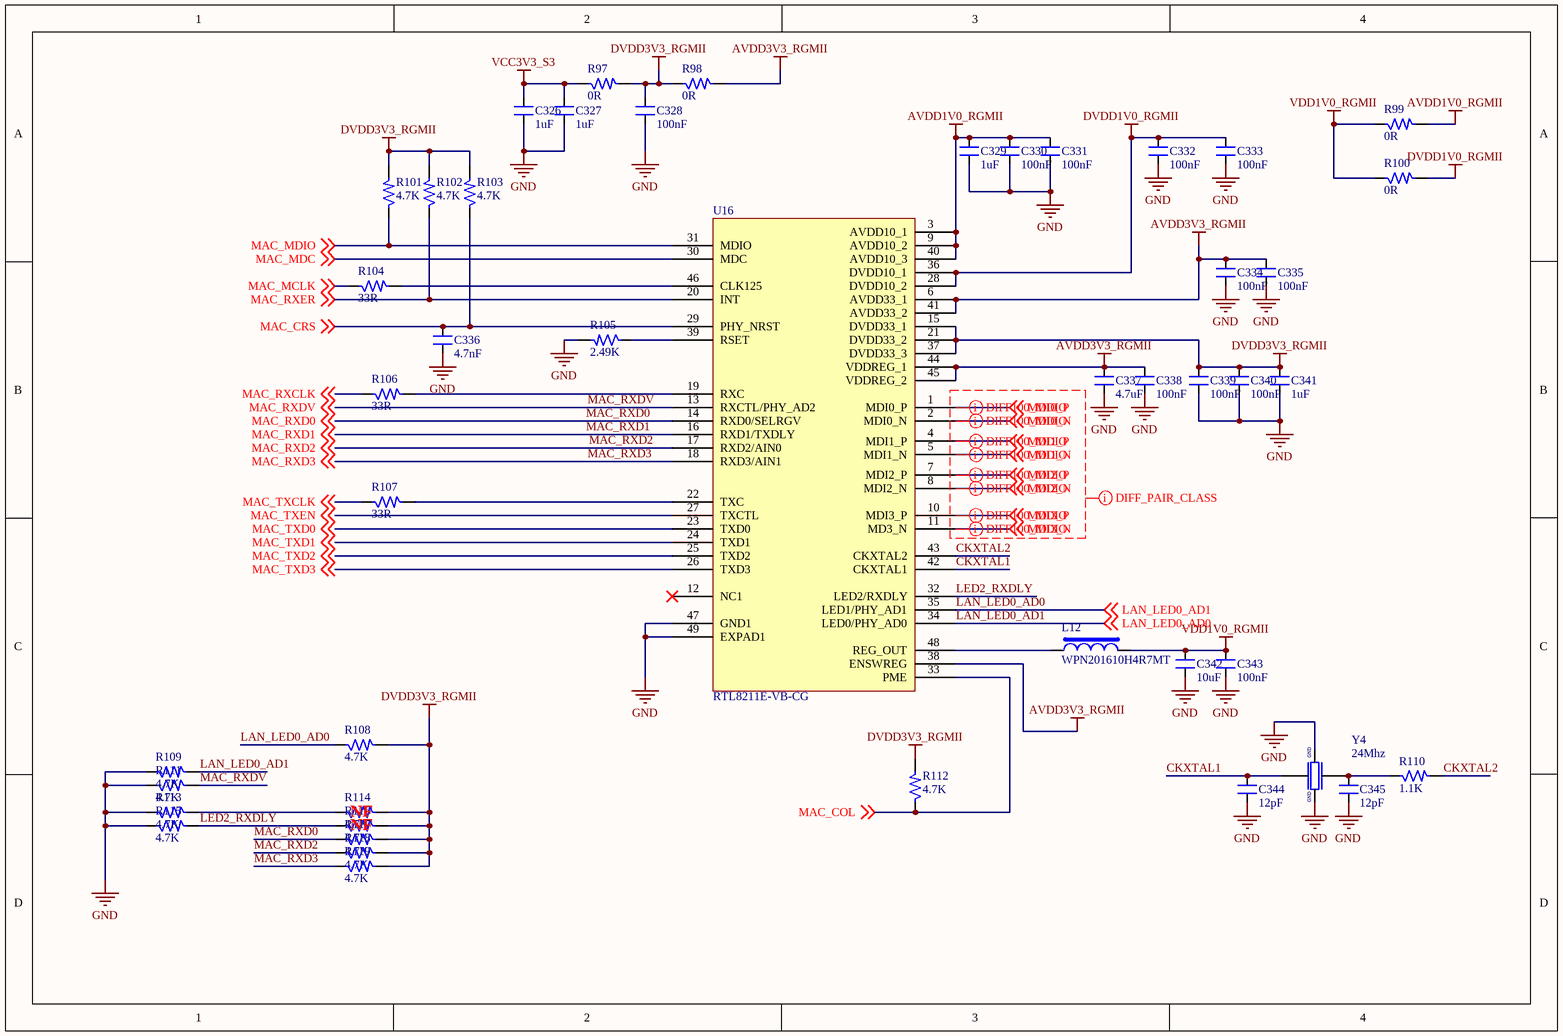
[diagram p16: RGMII ETH PHY.SchDoc]

### Parts
C326  1uF  [CAP_0603]
C327  1uF  [CAP_0603]
C328  100nF  [CAP_0603]
C329  1uF  [CAP_0603]
C330  100nF  [CAP_0603]
C331  100nF  [CAP_0603]
C332  100nF  [CAP_0603]
C333  100nF  [CAP_0603]
C334  100nF  [CAP_0603]
C335  100nF  [CAP_0603]
C336  4.7nF  [CAP_0603]
C337  4.7uF  [CAP_0603]
C338  100nF  [CAP_0603]
C339  100nF  [CAP_0603]
C340  100nF  [CAP_0603]
C341  1uF  [CAP_0603]
C342  10uF  [CAP_0603]
C343  100nF  [CAP_0603]
C344  12pF  [CAP_0603]
C345  12pF  [CAP_0603]
L12  WPN201610H4R7MT  [IND_62.9_110X86.6_SMD]
R97  0R  [RES_0603]
R98  0R  [RES_0603]
R99  0R  [RES_0603]
R100  0R  [RES_0603]
R101  4.7K  [RES_0603]
R102  4.7K  [RES_0603]
R103  4.7K  [RES_0603]
R104  33R  [RES_0402]
R105  2.49K  [RES_0603]
R106  33R  [RES_0402]
R107  33R  [RES_0402]
R108  4.7K  [RES_0603]
R109  4.7K  [RES_0603]
R110  1.1K  [RES_0603]
R111  4.7K  [RES_0603]
R112  4.7K  [RES_0603]
R113  4.7K  [RES_0603]
R114  4.7K  [RES_0603]
R115  4.7K  [RES_0603]
R116  4.7K  [RES_0603]
R117  4.7K  [RES_0603]
R118  4.7K  [RES_0603]
R119  4.7K  [RES_0603]
U16  RTL8211E-VB-CG  [QFN48_19.6_324X324_SMD]
Y4  24Mhz  [XTAL_ABM8AIG-24.000MHZ-12-2Z-T3]

### Nets
AVDD1V0_RGMII: C329.2 C330.2 C331.2 R99.2 U16.3(AVDD10_1) U16.9(AVDD10_2) U16.40(AVDD10_3)
AVDD3V3_RGMII: C334.2 C335.2 C337.2 C338.2 R98.2 U16.6(AVDD33_1) U16.38(ENSWREG) U16.41(AVDD33_2) U16.44(VDDREG_1) U16.45(VDDREG_2)
DVDD1V0_RGMII: C332.2 C333.2 R100.2 U16.28(DVDD10_2) U16.36(DVDD10_1)
DVDD3V3_RGMII: C328.2 C339.2 C340.2 C341.2 R97.2 R98.1 R101.2 R102.2 R103.2 R108.2 R112.2 R114.2 R116.2 R117.2 R118.2 R119.2 U16.15(DVDD33_1) U16.21(DVDD33_2) U16.37(DVDD33_3)
GND: C326.1 C327.1 C328.1 C329.1 C330.1 C331.1 C332.1 C333.1 C334.1 C335.1 C336.1 C337.1 C338.1 C339.1 C340.1 C341.1 C342.1 C343.1 C344.1 C345.1 R105.2 R109.1 R111.1 R113.1 R115.1 U16.47(GND1) U16.49(EXPAD1) Y4.2 Y4.4
VCC3V3_S3: C326.2 C327.2 R97.1
VDD1V0_RGMII: C342.2 C343.2 L12.2 R99.1 R100.1
CKXTAL1: C344.2 U16.42(CKXTAL1) Y4.1
CKXTAL2: R110.2 U16.43(CKXTAL2)
LAN_LED0_AD0: R108.1 R109.2 U16.34(LED0/PHY_AD0) U16.35(LED1/PHY_AD1) ; off-sheet LAN_LED0_AD0, off-sheet LAN_LED0_AD1  [also labelled LAN_LED0_AD1]
LED2_RXDLY: R115.2 R116.1 U16.32(LED2/RXDLY)
MAC_COL: R112.1 U16.33(PME) ; off-sheet MAC_COL
MAC_CRS: C336.2 R103.1 U16.29(PHY_NRST) ; off-sheet MAC_CRS
MAC_MCLK: R104.1 ; off-sheet MAC_MCLK
MAC_MDC: U16.30(MDC) ; off-sheet MAC_MDC
MAC_MDIO: R101.1 U16.31(MDIO) ; off-sheet MAC_MDIO
MAC_RXCLK: R106.1 ; off-sheet MAC_RXCLK
MAC_RXD0: R117.1 U16.14(RXD0/SELRGV) ; off-sheet MAC_RXD0
MAC_RXD1: U16.16(RXD1/TXDLY) ; off-sheet MAC_RXD1
MAC_RXD2: R118.1 U16.17(RXD2/AIN0) ; off-sheet MAC_RXD2
MAC_RXD3: R119.1 U16.18(RXD3/AIN1) ; off-sheet MAC_RXD3
MAC_RXDV: R111.2 U16.13(RXCTL/PHY_AD2) ; off-sheet MAC_RXDV
MAC_RXER: R102.1 U16.20(INT) ; off-sheet MAC_RXER
MAC_TXCLK: R107.1 ; off-sheet MAC_TXCLK
MAC_TXD0: U16.23(TXD0) ; off-sheet MAC_TXD0
MAC_TXD1: U16.24(TXD1) ; off-sheet MAC_TXD1
MAC_TXD2: U16.25(TXD2) ; off-sheet MAC_TXD2
MAC_TXD3: U16.26(TXD3) ; off-sheet MAC_TXD3
MAC_TXEN: U16.27(TXCTL) ; off-sheet MAC_TXEN
MDI0_N: U16.2(MDI0_N) ; off-sheet MDI0_N
MDI0_P: U16.1(MDI0_P) ; off-sheet MDI0_P
MDI1_N: U16.5(MDI1_N) ; off-sheet MDI1_N
MDI1_P: U16.4(MDI1_P) ; off-sheet MDI1_P
MDI2_N: U16.8(MDI2_N) ; off-sheet MDI2_N
MDI2_P: U16.7(MDI2_P) ; off-sheet MDI2_P
MDI3_N: U16.11(MD3_N) ; off-sheet MDI3_N
MDI3_P: U16.10(MDI3_P) ; off-sheet MDI3_P
NetC345_2: C345.2 R110.1 Y4.3
NetL12_1: L12.1 U16.48(REG_OUT)
NetR104_2: R104.2 U16.46(CLK125)
NetR105_1: R105.1 U16.39(RSET)
NetR106_2: R106.2 U16.19(RXC)
NetR107_2: R107.2 U16.22(TXC)
NetR113_2: R113.2 R114.1

Not connected (* = marked no-connect by the designer): U16 12(NC1)*

### Layout directives
differential pair; differential pair class DIFF100_MDIO: MDI0_N, MDI0_P, MDI1_N, MDI1_P, MDI2_N, MDI2_P, MDI3_N, MDI3_P
net class DIFF_PAIR_CLASS: MDI0_N, MDI0_P, MDI1_N, MDI1_P, MDI2_N, MDI2_P, MDI3_N, MDI3_P

### Notes on the sheet
- NF
- TITLE:
- DOCUMENT NAME:
- SCALE 1:1
- This document is copyright of EsteemPCB and shall not be revealed, produced, copied, in whole or in part, nor
- PROJECT CODE:
- TEMPLATE:
- A4
- AUTHOR:
- Sheet
- of
- used for any purpose other than submitted.
- (in symbol XTAL_24Mhz-12pF-4-SMD) GND

### Library data of the parts
C326 C327 C329 C341 = CAP_1uF-10V-5%-0603: as C287 on sheet Regulators and Buck Converters; Case/Package: 0603; Supplier-1: Digikey
C328 C330-C335 C338-C340 C343 = CAP_100nF-10V-5%-0603: as C285 on sheet Regulators and Buck Converters; Case/Package: 0603; Supplier-1: Digikey
C336 = CAP_4.7nF-10V-10%-0603: 4700pF ±10% 10V Ceramic Capacitor X7R 0603 (1608 Metric) /; Manufacturer: KEMET; Manufacturer Part Number: C0603C472K8RACTU; Case/Package: 0603; Supplier-1: Digikey
C337 = CAP_4.7uF-16V-10%-0603: 4.7µF ±10% 16V Ceramic Capacitor X5R 0603 (1608 Metric) /; Manufacturer: Murata Electronics; Manufacturer Part Number: GRM188R61C475KAAJD; Case/Package: 0603; Supplier-1: Digikey
C342 = CAP_10uF-10V-10%-0603: as C309 on sheet Power Supply for CPU Blocks; Case/Package: 0603; Supplier-1: Digikey
C344 C345 = CAP_12pF-10V-10%-0603: 12pF ±10% 10V Ceramic Capacitor X8R 0603 (1608 Metric) /; Manufacturer: KEMET; Manufacturer Part Number: C0603X120K8HAC7867; Case/Package: 0603; Supplier-1: Digikey
L12 = IND_4.7uH-0.9A-20%-SMD: 4.7uH ±20% 900mA 425mΩ SMD,2.0x1.6x1.0mm Power Inductors RoHS /; Manufacturer: Sunlord; Manufacturer Part Number: WPN201610H4R7MT; Case/Package: SMD; Supplier-1: LCSC
R97-R100 = RES_0R-0.1W-1%-0603: as R95 on sheet Power Supply for CPU Blocks; Case/Package: 0603; Supplier-1: Digikey
R101-R103 R108 R109 R111-R119 = RES_4.7K-0.1W-1%-0603: 4.7 kOhms ±1% 0.1W, 1/10W Chip Resistor 0603 (1608 Metric) Automotive AEC-Q200, Moisture Resistant Thick Film /; Manufacturer: TE Connectivity Passive Product; Manufacturer Part Number: CRGCQ0603F4K7; Case/Package: 0603; Supplier-1: Digikey
R104 R106 R107 = RES_33R-0.1W-1%-0402: 33 Ohms ±1% 0.1W, 1/10W Chip Resistor 0402 (1005 Metric) Automotive AEC-Q200 Thick Film /; Manufacturer: Panasonic Electronic Components; Manufacturer Part Number: ERJ-2RKF33R0X; Case/Package: 0402; Supplier-1: Digikey
R105 = RES_2.49K-0.1W-1%-0603: 2.49 kOhms ±1% 0.1W, 1/10W Chip Resistor 0603 (1608 Metric) Automotive AEC-Q200 Thick Film /; Manufacturer: Stackpole Electronics Inc; Manufacturer Part Number: RMCF0603FT2K49; Case/Package: 0603; Supplier-1: Digikey
R110 = RES_1.1K-0.1W-1%-0603: as R85 on sheet Power Supply for CPU Blocks; Case/Package: 0603; Supplier-1: Digikey
U16 = IC_RTL8211E-VB-CG: Ethernet Transceivers 10/100/1000 Base-T PHY GMII, MII, RGMII 1.43V ~ 3.63V QFN-48_6x6x04P Ethernet ICs RoHS; Manufacturer: Realtek Semicon; Manufacturer Part Number: RTL8211E-VB-CG; Case/Package: QFN-48; Supplier-1: LCSC
Y4 = XTAL_24Mhz-12pF-4-SMD: 24MHz ±20ppm Crystal 12pF 50 Ohms 4-SMD, No Lead /; Manufacturer: Abracon LLC; Manufacturer Part Number: ABM8AIG-24.000MHZ-12-2Z-T3; Case/Package: SMD; Supplier-1: Digikey

## Sheet RJ45 Connector and ESD Diodes.SchDoc: RK3399 COB Design V1.0
size A4; Author: AVIRAL MISHRA; DocumentNumber: 18; SheetNumber: 18; SheetTotal: 27; PROJECT CODE: A_V1.0
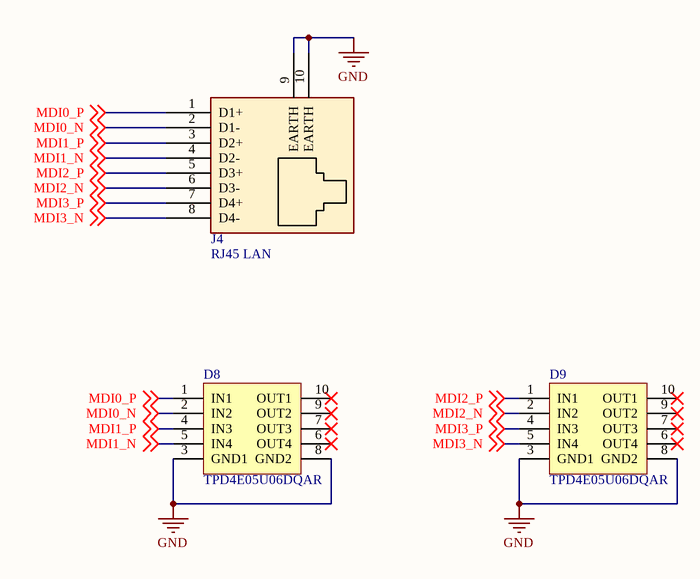
[diagram p17: RJ45 Connector and ESD Diodes.SchDoc]

### Parts
D8  TPD4E05U06DQAR  [DIO_USON-10_SMD]
D9  TPD4E05U06DQAR  [DIO_USON-10_SMD]
J4  RJ45 LAN  [CON10_P106_RJ45_TH_ST]

### Nets
GND: D8.3(GND1) D8.8(GND2) D9.3(GND1) D9.8(GND2) J4.9(EARTH) J4.10(EARTH)
MDI0_N: D8.2(IN2) J4.2(D1-) ; off-sheet MDI0_N
MDI0_P: D8.1(IN1) J4.1(D1+) ; off-sheet MDI0_P
MDI1_N: D8.5(IN4) J4.4(D2-) ; off-sheet MDI1_N
MDI1_P: D8.4(IN3) J4.3(D2+) ; off-sheet MDI1_P
MDI2_N: D9.2(IN2) J4.6(D3-) ; off-sheet MDI2_N
MDI2_P: D9.1(IN1) J4.5(D3+) ; off-sheet MDI2_P
MDI3_N: D9.5(IN4) J4.8(D4-) ; off-sheet MDI3_N
MDI3_P: D9.4(IN3) J4.7(D4+) ; off-sheet MDI3_P

Not connected (* = marked no-connect by the designer): D8 6(OUT4)* 7(OUT3)* 9(OUT2)* 10(OUT1)*; D9 6(OUT4)* 7(OUT3)* 9(OUT2)* 10(OUT1)*

### Notes on the sheet
- TITLE:
- DOCUMENT NAME:
- SCALE 1:1
- This document is copyright of EsteemPCB and shall not be revealed, produced, copied, in whole or in part, nor
- PROJECT CODE:
- TEMPLATE:
- A4
- AUTHOR:
- Sheet
- of
- used for any purpose other than submitted.

### Library data of the parts
D8 D9 = DIO-T_5.5V-14V-2.5A-10-USON: 14V Clamp 2.5A (8/20µs) Ipp Tvs Diode Surface Mount 10-USON (2.5x1) /; Manufacturer: Texas Instruments; Manufacturer Part Number: TPD4E05U06DQAR; Case/Package: 10-USON; Supplier-1: Digikey
J4 = CON-SKT-RJ_8C8P-RA-TH: 8 Pins, 2 Row 2.54mm Pitch, right angle Connector, male; Manufacturer: Assmann; Manufacturer Part Number: A-2004-2-4-LPS-N-R; Case/Package: TH-CON; Supplier-1: SP ROAD

## Sheet HDMI Connector for RK3399.SchDoc: RK3399 COB Design V1.0
size A4; Author: AVIRAL MISHRA; DocumentNumber: 19; SheetNumber: 19; SheetTotal: 27; PROJECT CODE: A_V1.0
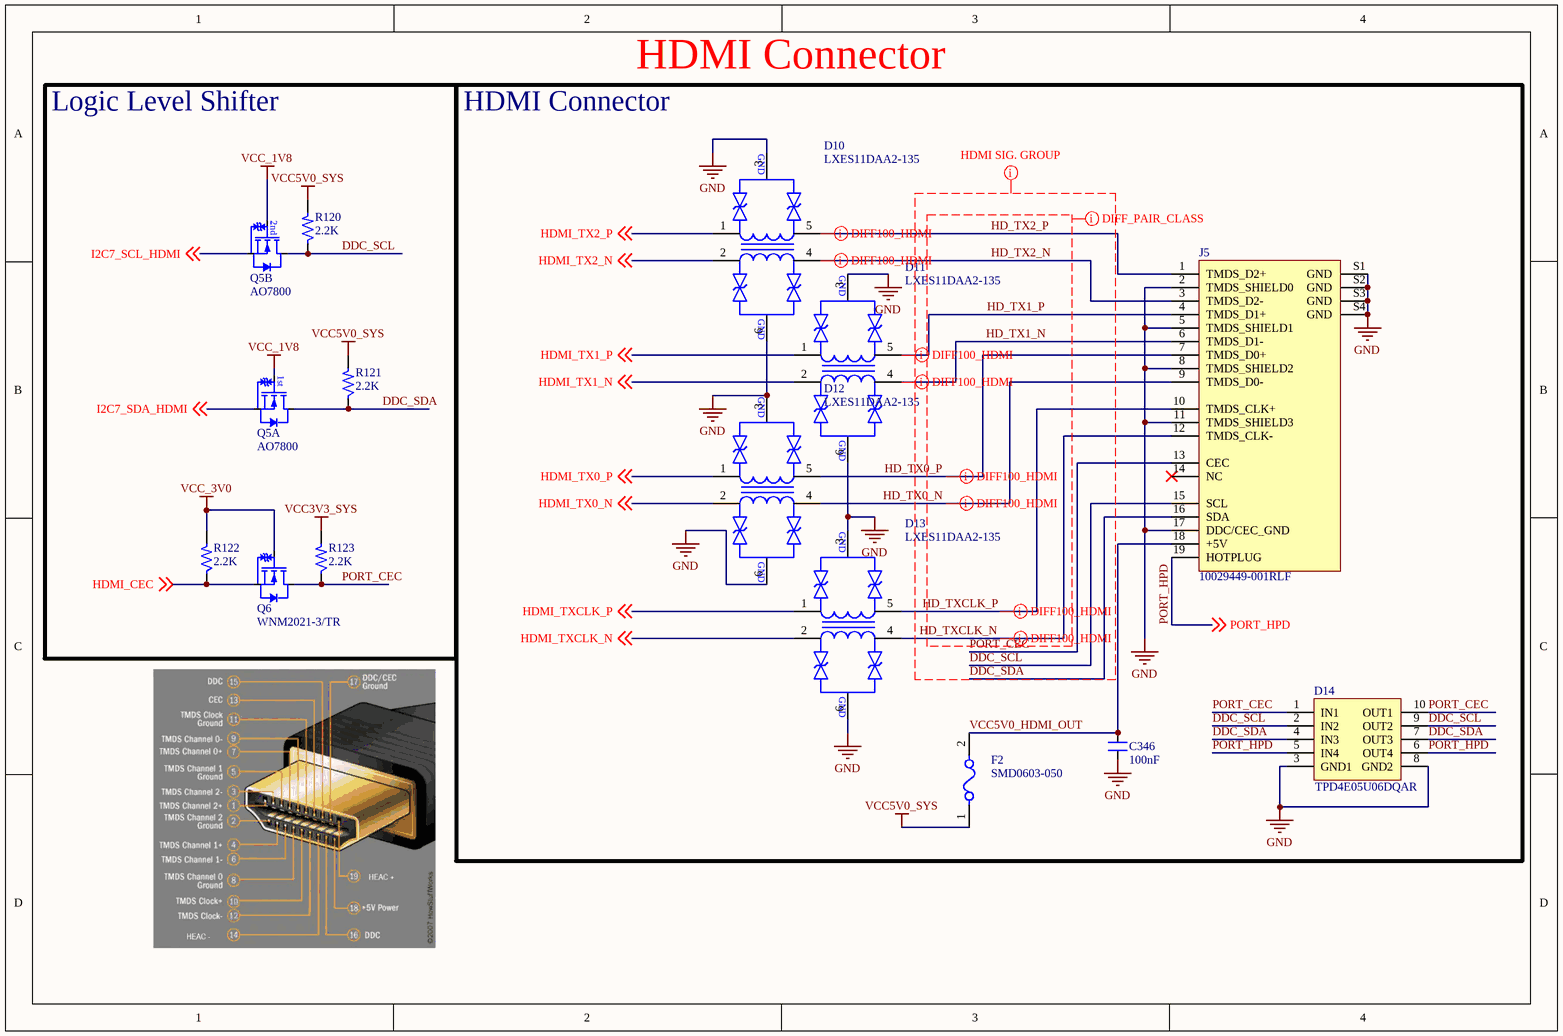
[diagram p18: HDMI Connector for RK3399.SchDoc]

### Parts
C346  100nF  [CAP_0603]
D10  LXES11DAA2-135  [DIO_LXES11D_SMD]
D11  LXES11DAA2-135  [DIO_LXES11D_SMD]
D12  LXES11DAA2-135  [DIO_LXES11D_SMD]
D13  LXES11DAA2-135  [DIO_LXES11D_SMD]
D14  TPD4E05U06DQAR  [DIO_USON-10_SMD]
F2  SMD0603-050  [RES_0603]
J5  10029449-001RLF  [CON19_19.6_10029449-001RLF_TH_RA]
Q5  AO7800  [SOT363-6]  (parts A,B of 2)
Q6  WNM2021-3/TR  [SOT-323-3]
R120  2.2K  [RES_0603]
R121  2.2K  [RES_0603]
R122  2.2K  [RES_0603]
R123  2.2K  [RES_0603]

### Blocks framed on the sheet
Logic Level Shifter: Q5 Q6 R120-R123
HDMI Connector: C346 D10-D14 F2 J5

### Nets
GND: C346.1 D10.3 D10.6 D11.3 D11.6 D12.3 D12.6 D13.3 D13.6 D14.3(GND1) D14.8(GND2) J5.2(TMDS_SHIELD0) J5.5(TMDS_SHIELD1) J5.8(TMDS_SHIELD2) J5.11(TMDS_SHIELD3) J5.17(DDC/CEC_GND) J5.S1(GND) J5.S2(GND) J5.S3(GND) J5.S4(GND)
VCC3V3_SYS: R123.2
VCC5V0_SYS: F2.1 R120.2 R121.2
VCC_1V8: Q5.2(G1) Q5.5(G2)
VCC_3V0: Q6.1(G) R122.2
DDC_SCL: D14.2(IN2) D14.9(OUT2) J5.15(SCL) Q5.3(D2) R120.1
DDC_SDA: D14.4(IN3) D14.7(OUT3) J5.16(SDA) Q5.6(D1) R121.1
HD_TX0_N: D12.4 J5.9(TMDS_D0-)
HD_TX0_P: D12.5 J5.7(TMDS_D0+)
HD_TX1_N: D11.4 J5.6(TMDS_D1-)
HD_TX1_P: D11.5 J5.4(TMDS_D1+)
HD_TX2_N: D10.4 J5.3(TMDS_D2-)
HD_TX2_P: D10.5 J5.1(TMDS_D2+)
HD_TXCLK_N: D13.4 J5.12(TMDS_CLK-)
HD_TXCLK_P: D13.5 J5.10(TMDS_CLK+)
HDMI_CEC: Q6.2(S) R122.1 ; off-sheet HDMI_CEC
HDMI_TX0_N: D12.2 ; off-sheet HDMI_TX0_N
HDMI_TX0_P: D12.1 ; off-sheet HDMI_TX0_P
HDMI_TX1_N: D11.2 ; off-sheet HDMI_TX1_N
HDMI_TX1_P: D11.1 ; off-sheet HDMI_TX1_P
HDMI_TX2_N: D10.2 ; off-sheet HDMI_TX2_N
HDMI_TX2_P: D10.1 ; off-sheet HDMI_TX2_P
HDMI_TXCLK_N: D13.2 ; off-sheet HDMI_TXCLK_N
HDMI_TXCLK_P: D13.1 ; off-sheet HDMI_TXCLK_P
I2C7_SCL_HDMI: Q5.4(S2) ; off-sheet I2C7_SCL_HDMI
I2C7_SDA_HDMI: Q5.1(S1) ; off-sheet I2C7_SDA_HDMI
PORT_CEC: D14.1(IN1) D14.10(OUT1) J5.13(CEC) Q6.3(D) R123.1
PORT_HPD: D14.5(IN4) D14.6(OUT4) J5.19(HOTPLUG) ; off-sheet PORT_HPD
VCC5V0_HDMI_OUT: C346.2 F2.2 J5.18(+5V)

Not connected (* = marked no-connect by the designer): J5 14(NC)*

### Layout directives
differential pair; differential pair class DIFF100_HDMI: HD_TX0_N, HD_TX0_P, HD_TX1_N, HD_TX1_P, HD_TX2_N, HD_TX2_P, HD_TXCLK_N, HD_TXCLK_P
net class HDMI SIG. GROUP: DDC_SCL, DDC_SDA, HD_TX1_N, HD_TX1_P, HD_TX2_N, HD_TX2_P, HD_TXCLK_N, HD_TXCLK_P, PORT_CEC
net class DIFF_PAIR_CLASS: HD_TX1_N, HD_TX1_P, HD_TX2_N, HD_TX2_P

### Notes on the sheet
- HDMI Connector
- TITLE:
- DOCUMENT NAME:
- SCALE 1:1
- This document is copyright of EsteemPCB and shall not be revealed, produced, copied, in whole or in part, nor
- PROJECT CODE:
- TEMPLATE:
- A4
- AUTHOR:
- Sheet
- of
- used for any purpose other than submitted.
- (in symbol DIO-T-A_5V-6SMD) GND
- (in symbol MOSFET-N_20V-0.9A-SOT-363, part A) 1st
- (in symbol MOSFET-N_20V-0.9A-SOT-363, part B) 2nd

### Library data of the parts
C346 = CAP_100nF-10V-5%-0603: as C285 on sheet Regulators and Buck Converters; Case/Package: 0603; Supplier-1: Digikey
D10-D13 = DIO-T-A_5V-6SMD: Clamp Ipp Tvs Diode Surface Mount 10-SMD; Manufacturer: Murata Electronics; Manufacturer Part Number: LXES11DAA2-135; Case/Package: SMD-6; Supplier-1: Digikey
D14 = DIO-T_5.5V-14V-2.5A-10-USON: as D8 on sheet RJ45 Connector and ESD Diodes; Manufacturer Part Number: TPD4E05U06DQAR; Case/Package: 10-USON; Supplier-1: Digikey
F2 = FUSE_1A-6V-0603: 6V 1A 0603 PTC Resettable Fuses RoHS; Manufacturer: TECHFUSE; Manufacturer Part Number: SMD0603-050; Case/Package: 0603; Supplier-1: LCSC
J5 = CON-HDMI_10029449-001RLF-RA-TH: HDMI HDMI 1.4 Receptacle Connector 19 Position Surface Mount, Right Angle; Through Hole; Manufacturer: Amphenol ICC (FCI); Manufacturer Part Number: 10029449-001RLF; Case/Package: TH; Supplier-1: Digikey
Q5 = MOSFET-N_20V-0.9A-SOT-363: DualNChannel 20V 900mA 900mV @ 250uA 300mΩ @ 900mA,4.5V 300mW SC-70-6(SOT-363) MOSFET RoHS /; Manufacturer: Alpha & Omega Semicon; Mnaufacturer Part Number: AO7800; Case/Package: SC-70-6(SOT-363); Supplier-1: LCSC
Q6 = MOSFET-N_20V-820mA-SOT-323: N Channel 20V 820mA 850mV @ 250uA 310mΩ @ 550mA,4.5V 310mW SOT-323(SC-70) MOSFET RoHS /; Manufacturer: WILLSEMI(Will Semicon); Manufacturer Part Number: WNM2021-3/TR; Case/Package: SOT-323(SC-70); Supplier-1: LCSC
R120-R123 = RES_2.2K-0.1W-1%-0603: 2.2 kOhms ±1% 0.1W, 1/10W Chip Resistor 0603 (1608 Metric) Thick Film /; Manufacturer: Yageo; Manufacturer Part Number: RC0603FR-072K2L; Case/Package: 0603; Supplier-1: Digikey

## Sheet TYPEC0 Connector.SchDoc: RK3399 COB Design V1.0
size A3; Author: ABC; Organization: Altium Limited; Address1: L3, 12a Rodborough Rd; Address2: Frenchs Forest; Address3: NSW; Address4: Australia 2086; DocumentNumber: 20; SheetNumber: 20; SheetTotal: 27; PROJECT CODE: A_V1.0
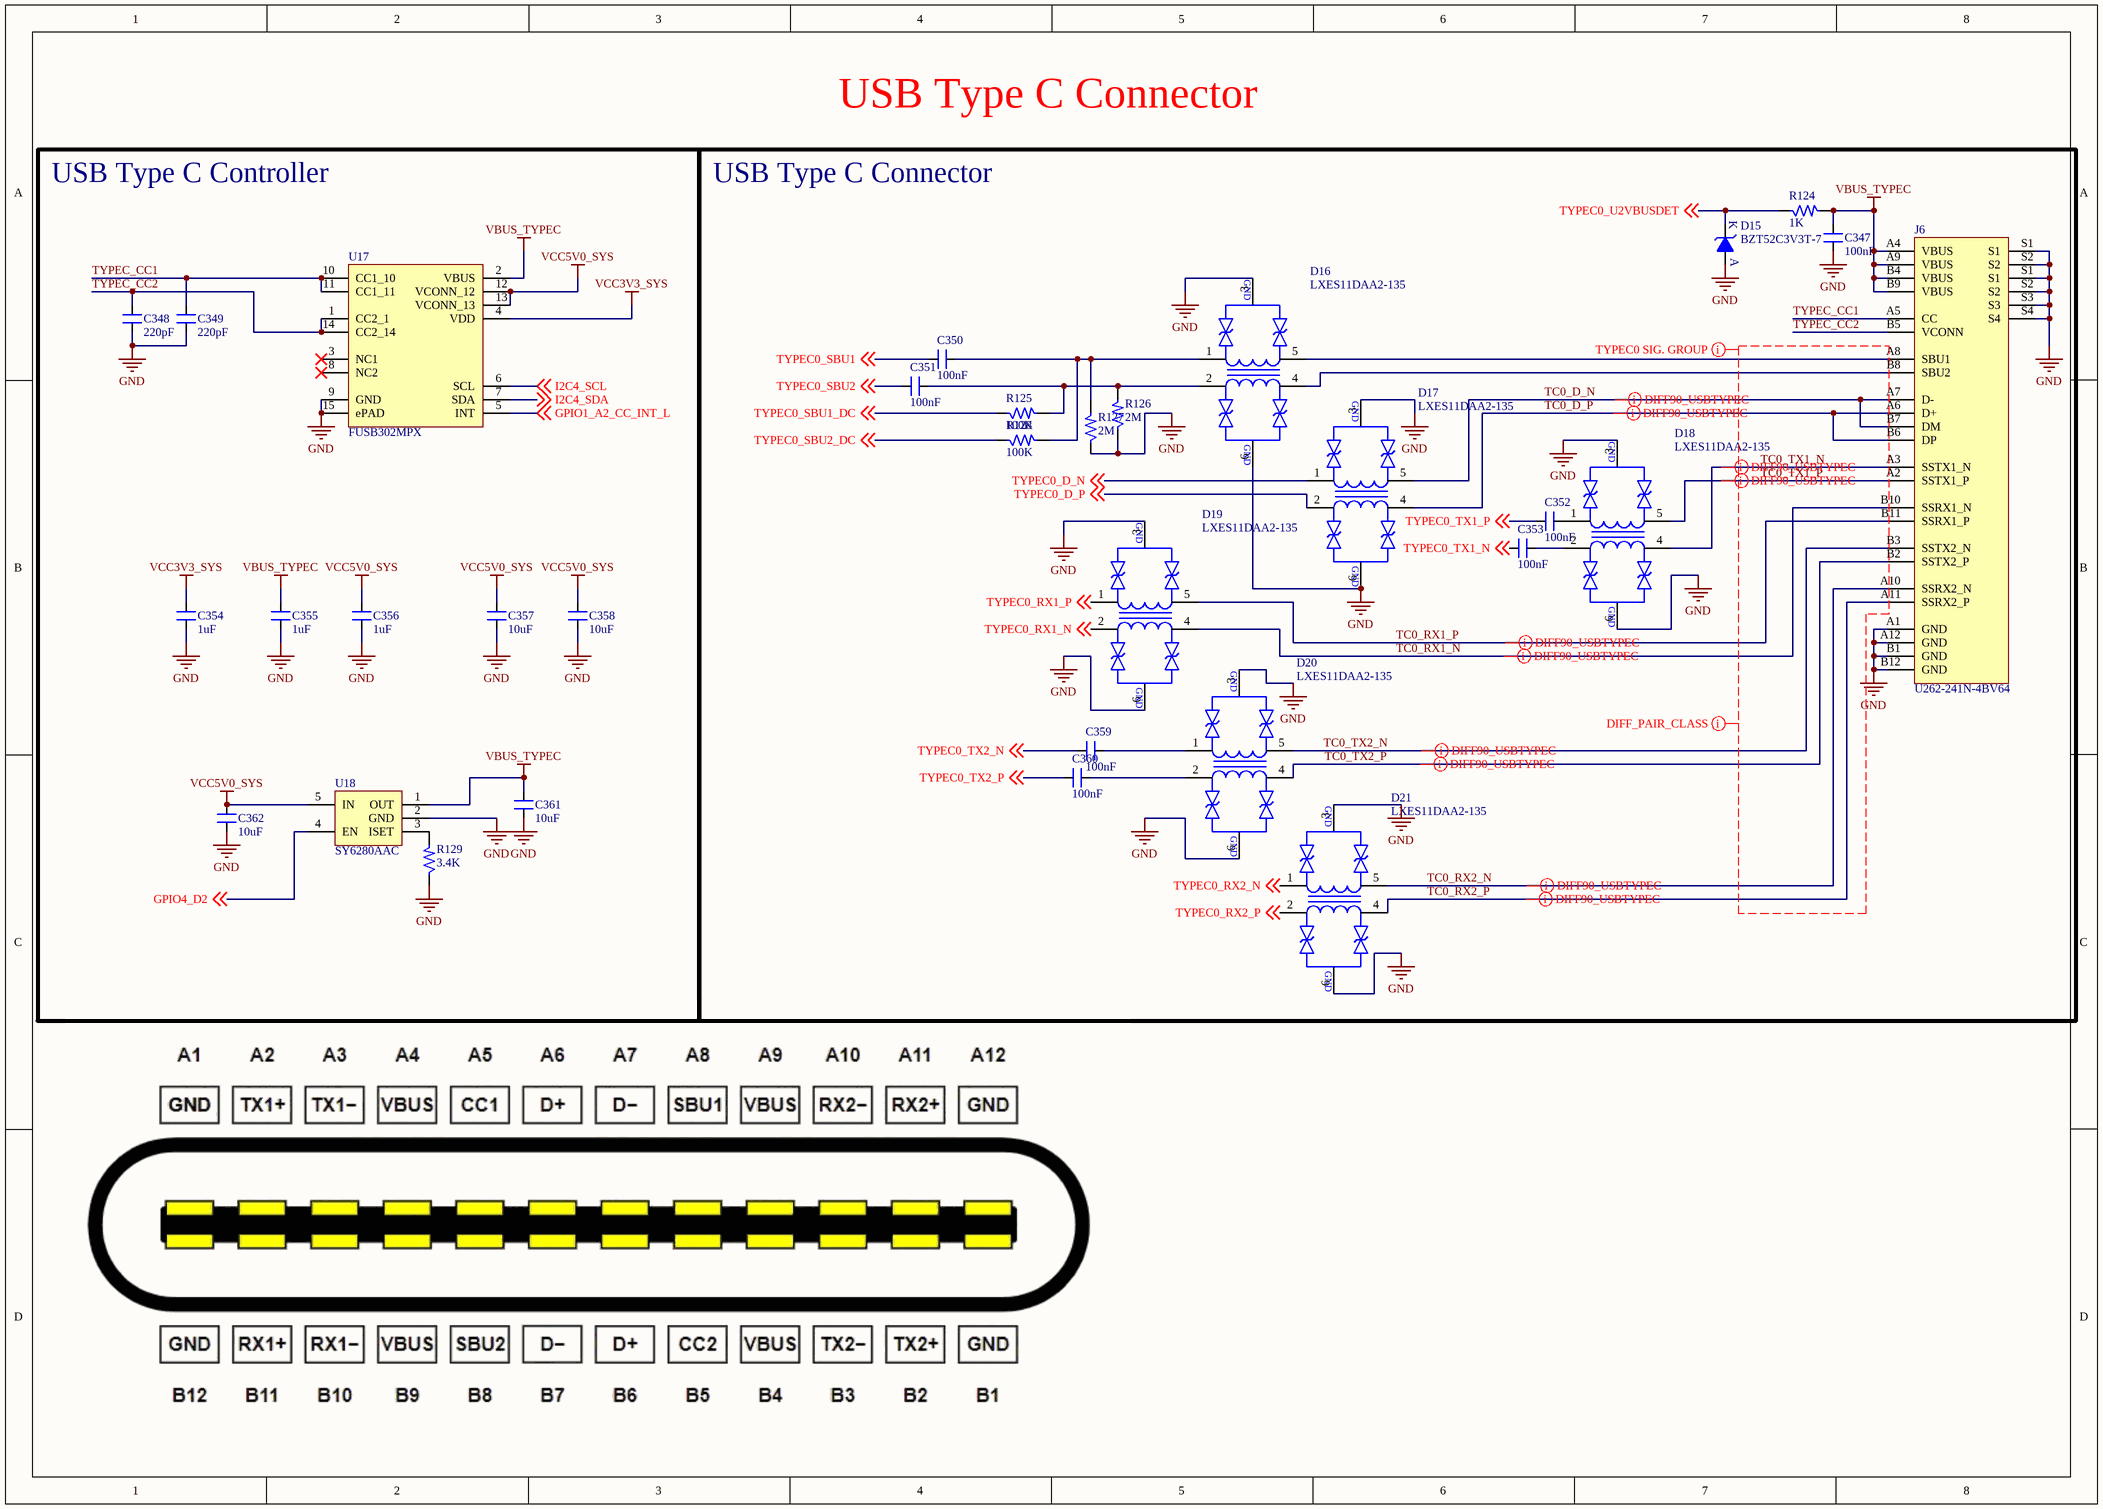
[diagram p19: TYPEC0 Connector.SchDoc]

### Parts
C347  100nF  [CAP_0603]
C348  220pF  [CAP_0603]
C349  220pF  [CAP_0603]
C350  100nF  [CAP_0402]
C351  100nF  [CAP_0402]
C352  100nF  [CAP_0402]
C353  100nF  [CAP_0402]
C354  1uF  [CAP_0603]
C355  1uF  [CAP_0603]
C356  1uF  [CAP_0603]
C357  10uF  [CAP_0805]
C358  10uF  [CAP_0805]
C359  100nF  [CAP_0402]
C360  100nF  [CAP_0402]
C361  10uF  [CAP_0805]
C362  10uF  [CAP_0805]
D15  BZT52C3V3T-7  [DIO_SOD523]
D16  LXES11DAA2-135  [DIO_LXES11D_SMD]
D17  LXES11DAA2-135  [DIO_LXES11D_SMD]
D18  LXES11DAA2-135  [DIO_LXES11D_SMD]
D19  LXES11DAA2-135  [DIO_LXES11D_SMD]
D20  LXES11DAA2-135  [DIO_LXES11D_SMD]
D21  LXES11DAA2-135  [DIO_LXES11D_SMD]
J6  U262-241N-4BV64  [CON24_19.64_U262-241N-4BV64_TH_RA]
R124  1K  [RES_0603]
R125  100K  [RES_0603]
R126  2M  [RES_0603]
R127  2M  [RES_0603]
R128  100K  [RES_0603]
R129  3.4K  [RES_0603]
U17  FUSB302MPX  [MLP-14_98.4X98.4_SMD]
U18  SY6280AAC  [SOT23-5]

### Blocks framed on the sheet
USB Type C Controller: C348 C349 C354-C358 C361 C362 R129 U17 U18
USB Type C Connector: C347 C350-C353 C359 C360 D15-D21 J6 R124-R128

### Nets
GND: C347.1 C348.1 C349.1 C354.1 C355.1 C356.1 C357.1 C358.1 C361.1 C362.1 D15.A D16.3 D16.6 D17.3 D17.6 D18.3 D18.6 D19.3 D19.6 D20.3 D20.6 D21.3 D21.6 J6.A1(GND) J6.A12(GND) J6.B1(GND) J6.B12(GND) J6.S1 J6.S2 J6.S3 J6.S4 R126.1 R127.1 R129.1 U17.9(GND) U17.15(ePAD) U18.2(GND)
VBUS_TYPEC: C347.2 C355.2 C361.2 J6.A4(VBUS) J6.A9(VBUS) J6.B4(VBUS) J6.B9(VBUS) R124.2 U17.2(VBUS) U18.1(OUT)
VCC3V3_SYS: C354.2 U17.4(VDD)
VCC5V0_SYS: C356.2 C357.2 C358.2 C362.2 U17.12(VCONN_12) U17.13(VCONN_13) U18.5(IN)
GPIO1_A2_CC_INT_L: U17.5(INT) ; off-sheet GPIO1_A2_CC_INT_L
GPIO4_D2: U18.4(EN) ; off-sheet GPIO4_D2
I2C4_SCL: U17.6(SCL) ; off-sheet I2C4_SCL
I2C4_SDA: U17.7(SDA) ; off-sheet I2C4_SDA
TC0_D_N: D17.5 J6.A7(D-) J6.B7(DM)
TC0_D_P: D17.4 J6.A6(D+) J6.B6(DP)
TC0_RX1_N: D19.4 J6.B10(SSRX1_N)
TC0_RX1_P: D19.5 J6.B11(SSRX1_P)
TC0_RX2_N: D21.5 J6.A10(SSRX2_N)
TC0_RX2_P: D21.4 J6.A11(SSRX2_P)
TC0_TX1_N: D18.4 J6.A3(SSTX1_N)
TC0_TX1_P: D18.5 J6.A2(SSTX1_P)
TC0_TX2_N: D20.5 J6.B3(SSTX2_N)
TC0_TX2_P: D20.4 J6.B2(SSTX2_P)
TYPEC0_D_N: D17.1 ; off-sheet TYPEC0_D_N
TYPEC0_D_P: D17.2 ; off-sheet TYPEC0_D_P
TYPEC0_RX1_N: D19.2 ; off-sheet TYPEC0_RX1_N
TYPEC0_RX1_P: D19.1 ; off-sheet TYPEC0_RX1_P
TYPEC0_RX2_N: D21.1 ; off-sheet TYPEC0_RX2_N
TYPEC0_RX2_P: D21.2 ; off-sheet TYPEC0_RX2_P
TYPEC0_SBU1: C350.1 ; off-sheet TYPEC0_SBU1
TYPEC0_SBU1_DC: R125.1 ; off-sheet TYPEC0_SBU1_DC
TYPEC0_SBU2: C351.1 ; off-sheet TYPEC0_SBU2
TYPEC0_SBU2_DC: R128.1 ; off-sheet TYPEC0_SBU2_DC
TYPEC0_TX1_N: C353.1 ; off-sheet TYPEC0_TX1_N
TYPEC0_TX1_P: C352.1 ; off-sheet TYPEC0_TX1_P
TYPEC0_TX2_N: C359.1 ; off-sheet TYPEC0_TX2_N
TYPEC0_TX2_P: C360.1 ; off-sheet TYPEC0_TX2_P
TYPEC0_U2VBUSDET: D15.K R124.1 ; off-sheet TYPEC0_U2VBUSDET
TYPEC_CC1: C349.2 J6.A5(CC) U17.10(CC1_10) U17.11(CC1_11)
TYPEC_CC2: C348.2 J6.B5(VCONN) U17.1(CC2_1) U17.14(CC2_14)
NetC350_2: C350.2 D16.1 R127.2 R128.2
NetC351_2: C351.2 D16.2 R125.2 R126.2
NetC352_2: C352.2 D18.1
NetC353_2: C353.2 D18.2
NetC359_2: C359.2 D20.1
NetC360_2: C360.2 D20.2
NetD16_4: D16.4 J6.B8(SBU2)
NetD16_5: D16.5 J6.A8(SBU1)
NetR129_2: R129.2 U18.3(ISET)

Not connected (* = marked no-connect by the designer): U17 3(NC1)* 8(NC2)*

### Layout directives
differential pair; differential pair class DIFF90_USBTYPEC: TC0_D_N, TC0_D_P, TC0_RX1_N, TC0_RX1_P, TC0_RX2_N, TC0_RX2_P, TC0_TX1_N, TC0_TX1_P, TC0_TX2_N, TC0_TX2_P
net class TYPEC0 SIG. GROUP: TC0_TX1_N, TC0_TX1_P
net class DIFF_PAIR_CLASS: TC0_TX1_N, TC0_TX1_P

### Notes on the sheet
- USB Type C Connector
- TITLE:
- DOCUMENT NAME:
- SCALE 1:1
- This document is copyright of Esteempcb and shall not be revealed, produced, copied, in whole or in part, nor
- PROJECT CODE:
- TEMPLATE:
- A3
- AUTHOR:
- Sheet
- of
- used for any purpose other than submitted.
- (in symbol DIO-T-A_5V-6SMD) GND

### Library data of the parts
C347 = CAP_100nF-10V-5%-0603: as C285 on sheet Regulators and Buck Converters; Case/Package: 0603; Supplier-1: Digikey
C348 C349 = CAP_220pF-10V-10%-0603: 220pF ±10% 10V Ceramic Capacitor X7R 0603 (1608 Metric) /; Manufacturer: KEMET; Manufacturer Part Number: C0603C221K8RAC7867; Case/Package: 0603; Supplier-1: Digikey
C350-C353 C359 C360 = CAP_100nF-10V-10%-0402: 0.1µF ±10% 10V Ceramic Capacitor X7R 0402 (1005 Metric) /; Manufacturer: Yageo; Manufacturer Part Number: CC0402KRX7R6BB104; Case/Package: 0402; Supplier-1: Digikey
C354-C356 = CAP_1uF-10V-5%-0603: as C287 on sheet Regulators and Buck Converters; Case/Package: 0603; Supplier-1: Digikey
C357 C358 C361 C362 = CAP_10uF-25V-10%-0805: as C281 on sheet Regulators and Buck Converters; Case/Package: 0805; Supplier-1: Digikey
D15 = DIO-Z_3.3V-300mW-SOD-523: Zener Diode 3.3V 300mW ±6% Surface Mount SOD-523 /; Manufacturer: Diodes Incorporated; Manufacturer Part Number: BZT52C3V3T-7; Case/Package: SOD523; Supplier-1: Digikey
D16-D21 = DIO-T-A_5V-6SMD: as D10 on sheet HDMI Connector for RK3399; Manufacturer Part Number: LXES11DAA2-135; Case/Package: SMD-6; Supplier-1: Digikey
J6 = CON-TYPEC_U262-241N-4BV64-SMD: USB - Type C Female 24 SMD USB Connectors RoHS; Manufacturer: XKB Connectivity; Manufacturer Part Number: U262-241N-4BV64; Case/Package: SMD; Supplier-1: LCSC
R124 = RES_1K-0.1W-1%-0603: 1 kOhms ±1% 0.1W, 1/10W Chip Resistor 0603 (1608 Metric) Thick Film /; Manufacturer: Yageo; Manufacturer Part Number: RC0603FR-071KL; Case/Package: 0603; Supplier-1: Digikey
R125 R128 = RES_100K-0.1W-1%-0603: as R70 on sheet Regulators and Buck Converters; Case/Package: 0603; Supplier-1: Digikey
R126 R127 = RES_2M-0.1W-1%-0603: 2 MOhms ±1% 0.1W, 1/10W Chip Resistor 0603 (1608 Metric) Automotive AEC-Q200, Moisture Resistant Thick Film /; Manufacturer: KOA Speer Electronics, Inc.; Manufacturer Part Number: RK73H1JTTD2004F; Case/Package: 0603; Supplier-1: Digikey
R129 = RES_3.4K-0.1W-1%-0603: 3.4 kOhms ±1% 0.1W, 1/10W Chip Resistor 0603 (1608 Metric) Automotive AEC-Q200 Thick Film /; Manufacturer: Stackpole Electronics Inc; Manufacturer Part Number: RMCF0603FT3K40; Case/Package: 0603; Supplier-1: Digikey
U17 = IC_FUSB302MPX: USB Controller USB 3.1 USB Interface 14-MLP (2.5x2.5); Manufacturer: ON Semiconductor; Manufacturer Part Number: FUSB302MPX; Case/Package: 14-MLP; Supplier-1: Digikey
U18 = REG-ADJ_5.5V-5.5V-1.25A-SOT-23-5: SOT-23-5 PMIC - Power Distribution Switches RoHS; Manufacturer: Silergy Corp; Manufacturer Part Number: SY6280AAC; Case/Package: SOT-23-5; Supplier-1: LCSC

## Sheet USB2.0 Host Connectors.SchDoc: RK3399 COB Design V1.0
size A4; Author: AVIRAL MISHRA; DocumentNumber: 21; SheetNumber: 21; SheetTotal: 27; PROJECT CODE: A_V1.0
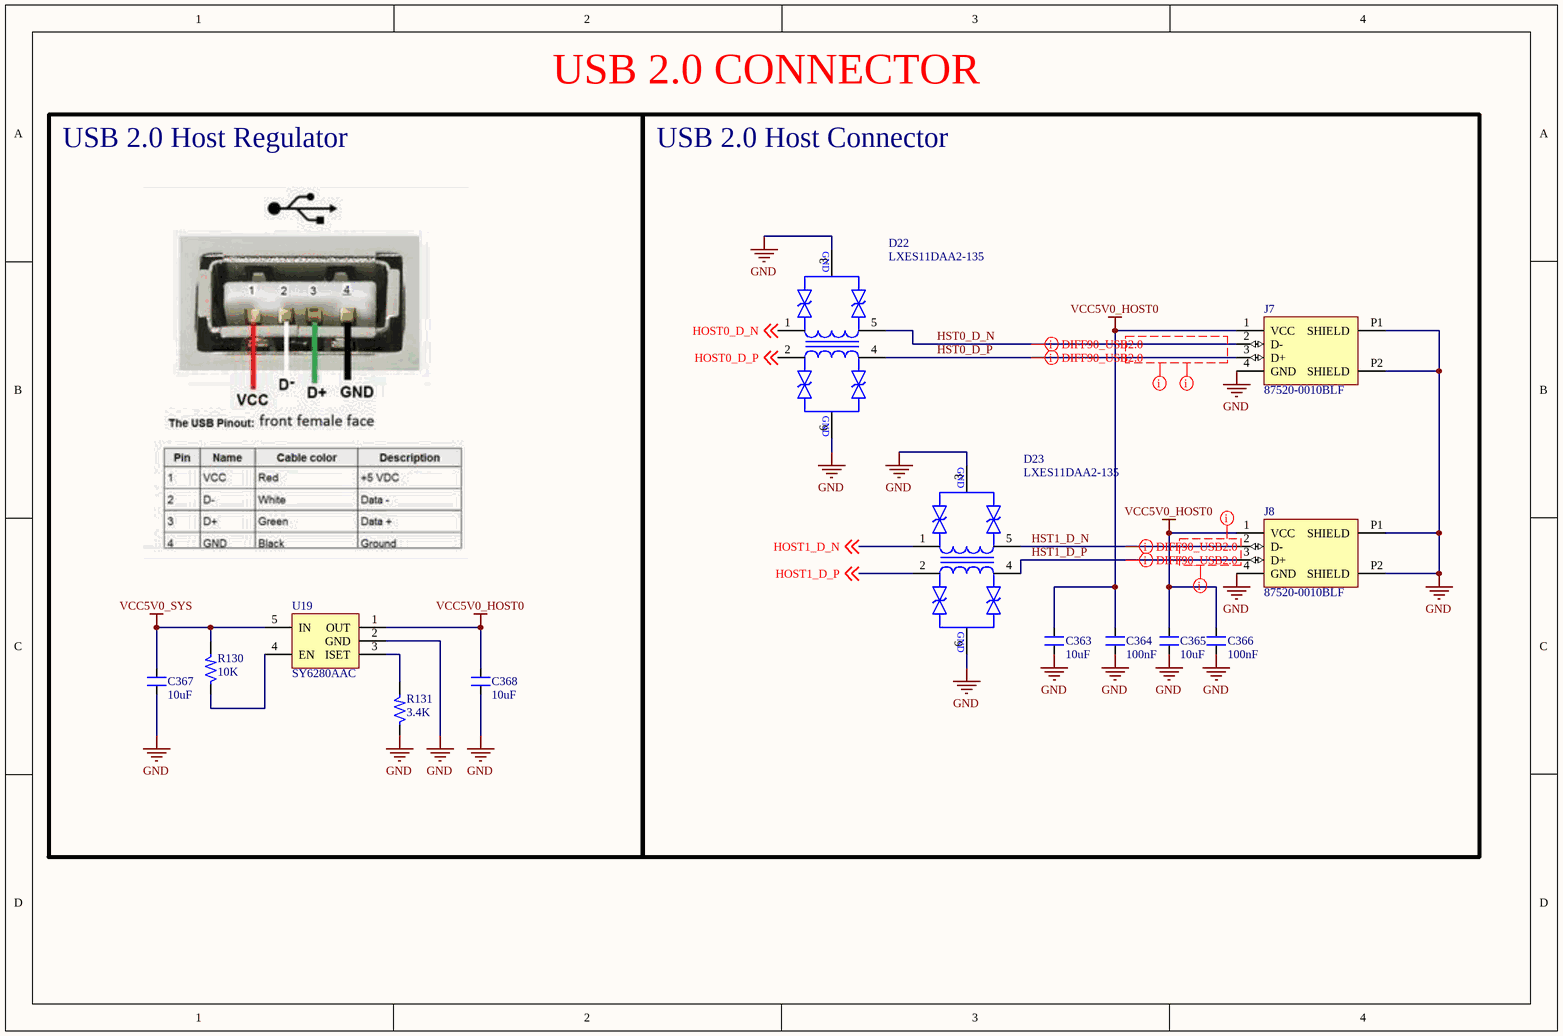
[diagram p20: USB2.0 Host Connectors.SchDoc]

### Parts
C363  10uF  [CAP_0805]
C364  100nF  [CAP_0805]
C365  10uF  [CAP_0805]
C366  100nF  [CAP_0805]
C367  10uF  [CAP_0805]
C368  10uF  [CAP_0805]
D22  LXES11DAA2-135  [DIO_LXES11D_SMD]
D23  LXES11DAA2-135  [DIO_LXES11D_SMD]
J7  87520-0010BLF  [CON4_614004134726_TH]
J8  87520-0010BLF  [CON4_614004134726_TH]
R130  10K  [RES_0603]
R131  3.4K  [RES_0603]
U19  SY6280AAC  [SOT23-5]

### Blocks framed on the sheet
USB 2.0 Host Regulator: C367 C368 R130 R131 U19
USB 2.0 Host Connector: C363-C366 D22 D23 J7 J8

### Nets
GND: C363.1 C364.1 C365.1 C366.1 C367.1 C368.1 D22.3 D22.6 D23.3 D23.6 J7.4(GND) J7.P1(SHIELD) J7.P2(SHIELD) J8.4(GND) J8.P1(SHIELD) J8.P2(SHIELD) R131.1 U19.2(GND)
VCC5V0_HOST0: C363.2 C364.2 C365.2 C366.2 C368.2 J7.1(VCC) J8.1(VCC) U19.1(OUT)
VCC5V0_SYS: C367.2 R130.2 U19.5(IN)
HOST0_D_N: D22.1 ; off-sheet HOST0_D_N
HOST0_D_P: D22.2 ; off-sheet HOST0_D_P
HOST1_D_N: D23.1 ; off-sheet HOST1_D_N
HOST1_D_P: D23.2 ; off-sheet HOST1_D_P
HST0_D_N: D22.5 J7.2(D-)
HST0_D_P: D22.4 J7.3(D+)
HST1_D_N: D23.5 J8.2(D-)
HST1_D_P: D23.4 J8.3(D+)
NetR130_1: R130.1 U19.4(EN)
NetR131_2: R131.2 U19.3(ISET)

### Layout directives
differential pair; differential pair class DIFF90_USB2.0: HST0_D_N, HST0_D_P, HST1_D_N, HST1_D_P
net class USB2.0 SIG. GROUP: (no net found under the mark)
net class DIFF_PAIR_CLASS: (no net found under the mark)

### Notes on the sheet
- USB 2.0 CONNECTOR
- TITLE:
- DOCUMENT NAME:
- SCALE 1:1
- This document is copyright of EsteemPCB and shall not be revealed, produced, copied, in whole or in part, nor
- PROJECT CODE:
- TEMPLATE:
- A4
- AUTHOR:
- Sheet
- of
- used for any purpose other than submitted.
- (in symbol DIO-T-A_5V-6SMD) GND

### Library data of the parts
C363 C365 C367 C368 = CAP_10uF-25V-10%-0805: as C281 on sheet Regulators and Buck Converters; Case/Package: 0805; Supplier-1: Digikey
C364 C366 = CAP_100nF-25V-10%-0805: as C278 on sheet Regulators and Buck Converters; Case/Package: 0805; Supplier-1: Digikey
D22 D23 = DIO-T-A_5V-6SMD: as D10 on sheet HDMI Connector for RK3399; Manufacturer Part Number: LXES11DAA2-135; Case/Package: SMD-6; Supplier-1: Digikey
J7 J8 = CON-SKT-USB_87520-0010BLF-RA-TH: USB-A (USB TYPE-A) USB 2.0 Receptacle Connector 4 Position Through Hole, Right Angle; Manufacturer: Amphenol ICC (FCI); Manufacturer Part Number: 87520-0010BLF; Case/Package: TH; Supplier-1: Digikey
R130 = RES_10K-0.1W-1%-0603: as R69 on sheet Regulators and Buck Converters; Case/Package: 0603; Supplier-1: Digikey
R131 = RES_3.4K-0.1W-1%-0603: as R129 on sheet TYPEC0 Connector; Case/Package: 0603; Supplier-1: Digikey
U19 = REG-ADJ_5.5V-5.5V-1.25A-SOT-23-5: as U18 on sheet TYPEC0 Connector; Manufacturer Part Number: SY6280AAC; Case/Package: SOT-23-5; Supplier-1: LCSC